# EAGLE design mcore-h616-breakout-RevA1 (EAGLE 9.6.2)

## Sheet 1 of 3
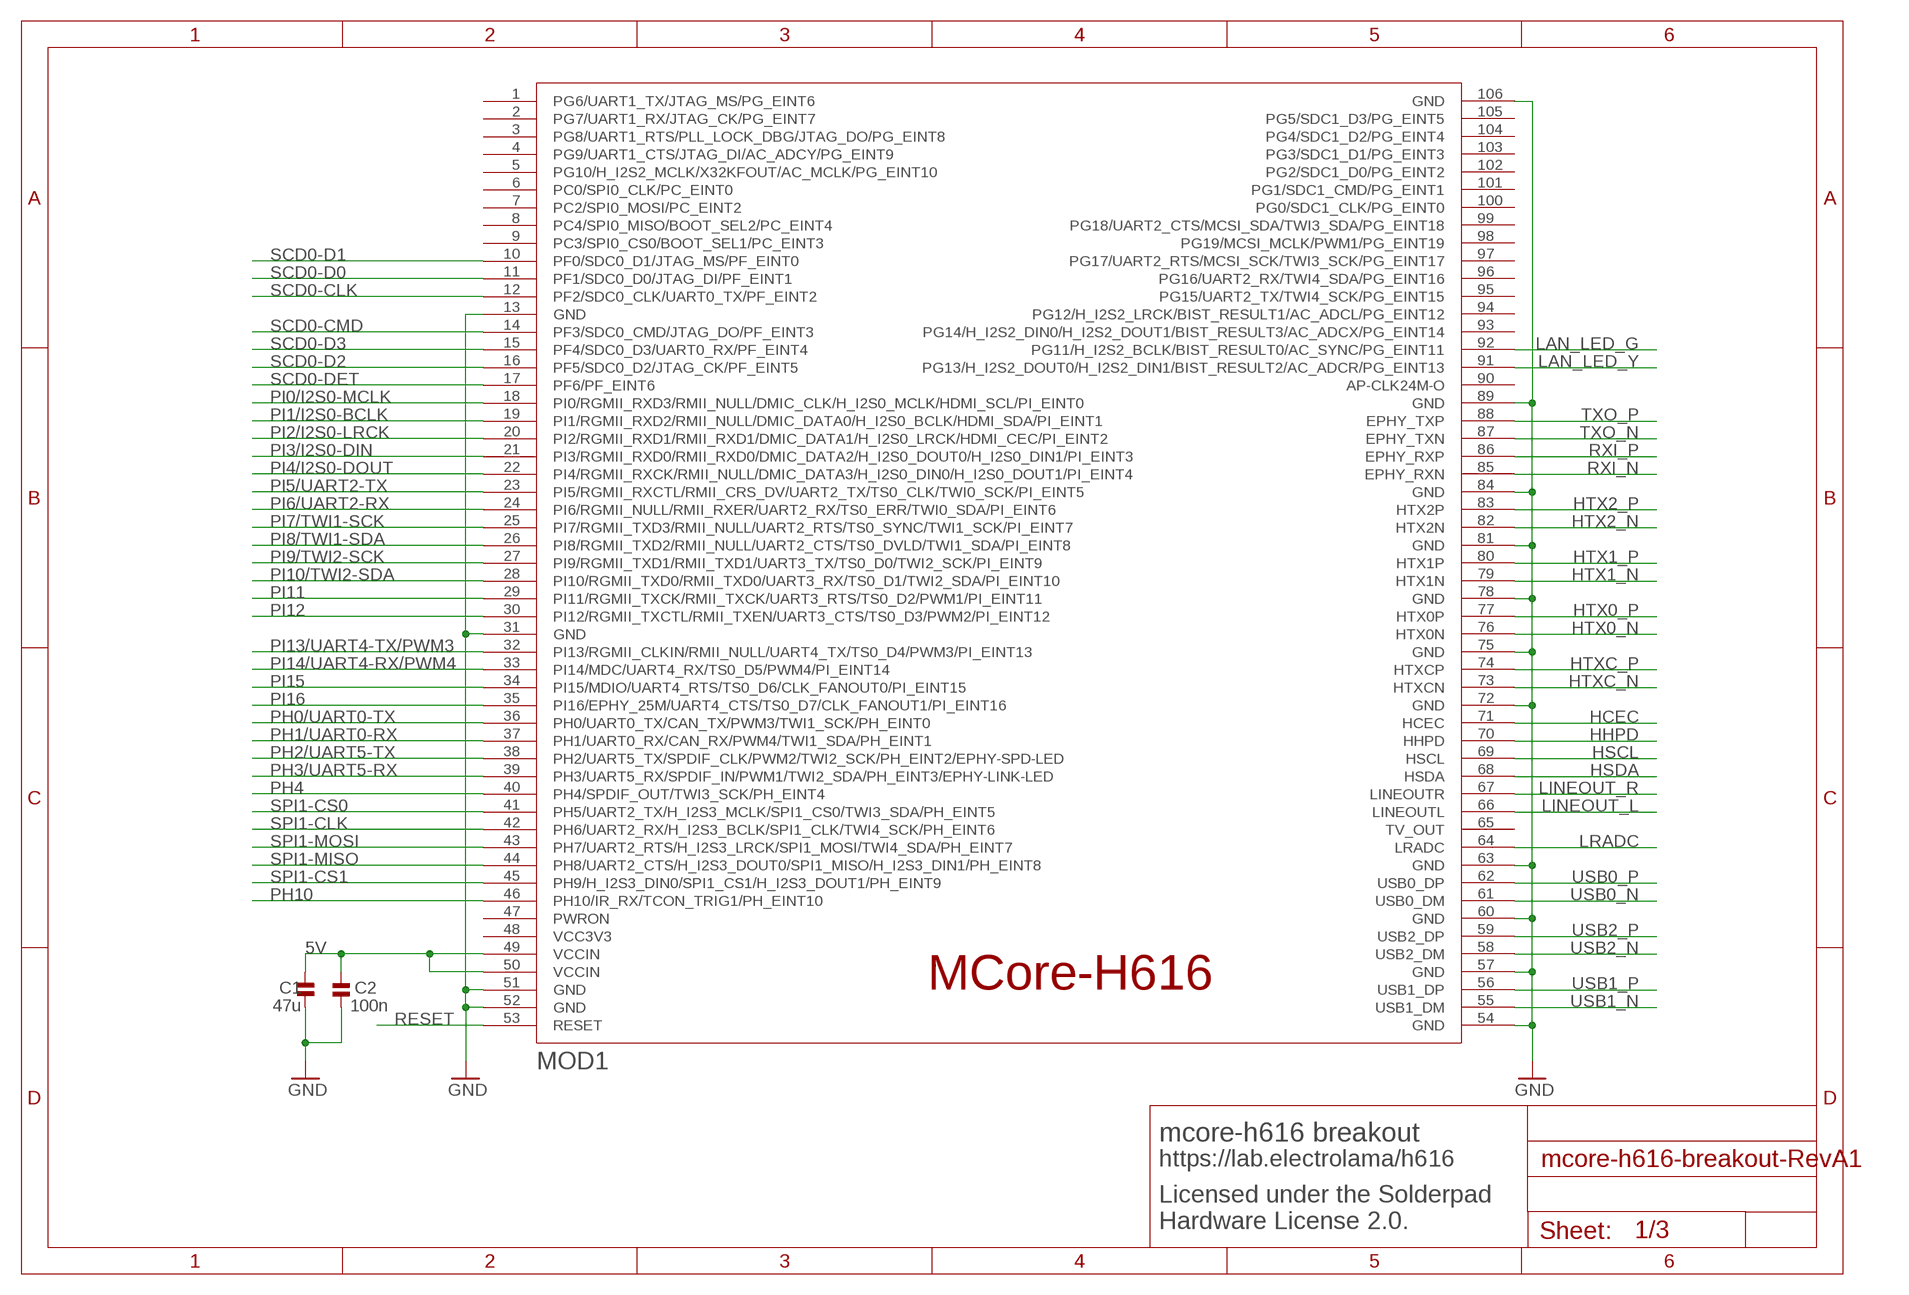
[diagram p0: schematic, sheet 1]

### Parts
C1  47u  CAP-1206  [_PKG_C_1206]
C2  100n  CAP-0402  [_PKG_C_0402]
MOD1  WIDORA_MCORE-H616_V1  [MCORE-H616_V1]

### Nets
5V: C1.2 C2.2 MOD1.49(VCCIN) MOD1.50(VCCIN) ; also sheet 2,3
GND: C1.1 C2.1 MOD1.13(GND) MOD1.31(GND) MOD1.51(GND) MOD1.52(GND) MOD1.54(GND) MOD1.57(GND) MOD1.60(GND) MOD1.63(GND) MOD1.72(GND) MOD1.75(GND) MOD1.78(GND) MOD1.81(GND) MOD1.84(GND) MOD1.89(GND) MOD1.106(GND) ; also sheet 2,3
HCEC: MOD1.71(HCEC) ; also sheet 3
HHPD: MOD1.70(HHPD) ; also sheet 3
HSCL: MOD1.69(HSCL) ; also sheet 3
HSDA: MOD1.68(HSDA) ; also sheet 3
HTX0_N: MOD1.76(HTX0N) ; also sheet 3
HTX0_P: MOD1.77(HTX0P) ; also sheet 3
HTX1_N: MOD1.79(HTX1N) ; also sheet 3
HTX1_P: MOD1.80(HTX1P) ; also sheet 3
HTX2_N: MOD1.82(HTX2N) ; also sheet 3
HTX2_P: MOD1.83(HTX2P) ; also sheet 3
HTXC_N: MOD1.73(HTXCN) ; also sheet 3
HTXC_P: MOD1.74(HTXCP) ; also sheet 3
LAN_LED_G: MOD1.92(PG11/H_I2S2_BCLK/BIST_RESULT0/AC_SYNC/PG_EINT11) ; also sheet 3
LAN_LED_Y: MOD1.91(PG13/H_I2S2_DOUT0/H_I2S2_DIN1/BIST_RESULT2/AC_ADCR/PG_EINT13) ; also sheet 3
LINEOUT_L: MOD1.66(LINEOUTL) ; also sheet 2
LINEOUT_R: MOD1.67(LINEOUTR) ; also sheet 2
LRADC: MOD1.64(LRADC) ; also sheet 2
PH0/UART0-TX: MOD1.36(PH0/UART0_TX/CAN_TX/PWM3/TWI1_SCK/PH_EINT0) ; also sheet 2,3
PH1/UART0-RX: MOD1.37(PH1/UART0_RX/CAN_RX/PWM4/TWI1_SDA/PH_EINT1) ; also sheet 2,3
PH2/UART5-TX: MOD1.38(PH2/UART5_TX/SPDIF_CLK/PWM2/TWI2_SCK/PH_EINT2/EPHY-SPD-LED) ; also sheet 3
PH3/UART5-RX: MOD1.39(PH3/UART5_RX/SPDIF_IN/PWM1/TWI2_SDA/PH_EINT3/EPHY-LINK-LED) ; also sheet 3
PH4: MOD1.40(PH4/SPDIF_OUT/TWI3_SCK/PH_EINT4) ; also sheet 3
PH10: MOD1.46(PH10/IR_RX/TCON_TRIG1/PH_EINT10) ; also sheet 3
PI0/I2S0-MCLK: MOD1.18(PI0/RGMII_RXD3/RMII_NULL/DMIC_CLK/H_I2S0_MCLK/HDMI_SCL/PI_EINT0) ; also sheet 3
PI1/I2S0-BCLK: MOD1.19(PI1/RGMII_RXD2/RMII_NULL/DMIC_DATA0/H_I2S0_BCLK/HDMI_SDA/PI_EINT1) ; also sheet 3
PI2/I2S0-LRCK: MOD1.20(PI2/RGMII_RXD1/RMII_RXD1/DMIC_DATA1/H_I2S0_LRCK/HDMI_CEC/PI_EINT2) ; also sheet 3
PI3/I2S0-DIN: MOD1.21(PI3/RGMII_RXD0/RMII_RXD0/DMIC_DATA2/H_I2S0_DOUT0/H_I2S0_DIN1/PI_EINT3) ; also sheet 3
PI4/I2S0-DOUT: MOD1.22(PI4/RGMII_RXCK/RMII_NULL/DMIC_DATA3/H_I2S0_DIN0/H_I2S0_DOUT1/PI_EINT4) ; also sheet 3
PI5/UART2-TX: MOD1.23(PI5/RGMII_RXCTL/RMII_CRS_DV/UART2_TX/TS0_CLK/TWI0_SCK/PI_EINT5) ; also sheet 3
PI6/UART2-RX: MOD1.24(PI6/RGMII_NULL/RMII_RXER/UART2_RX/TS0_ERR/TWI0_SDA/PI_EINT6) ; also sheet 3
PI7/TWI1-SCK: MOD1.25(PI7/RGMII_TXD3/RMII_NULL/UART2_RTS/TS0_SYNC/TWI1_SCK/PI_EINT7) ; also sheet 3
PI8/TWI1-SDA: MOD1.26(PI8/RGMII_TXD2/RMII_NULL/UART2_CTS/TS0_DVLD/TWI1_SDA/PI_EINT8) ; also sheet 3
PI9/TWI2-SCK: MOD1.27(PI9/RGMII_TXD1/RMII_TXD1/UART3_TX/TS0_D0/TWI2_SCK/PI_EINT9) ; also sheet 3
PI10/TWI2-SDA: MOD1.28(PI10/RGMII_TXD0/RMII_TXD0/UART3_RX/TS0_D1/TWI2_SDA/PI_EINT10) ; also sheet 3
PI11: MOD1.29(PI11/RGMII_TXCK/RMII_TXCK/UART3_RTS/TS0_D2/PWM1/PI_EINT11) ; also sheet 3
PI12: MOD1.30(PI12/RGMII_TXCTL/RMII_TXEN/UART3_CTS/TS0_D3/PWM2/PI_EINT12) ; also sheet 3
PI13/UART4-TX/PWM3: MOD1.32(PI13/RGMII_CLKIN/RMII_NULL/UART4_TX/TS0_D4/PWM3/PI_EINT13) ; also sheet 3
PI14/UART4-RX/PWM4: MOD1.33(PI14/MDC/UART4_RX/TS0_D5/PWM4/PI_EINT14) ; also sheet 3
PI15: MOD1.34(PI15/MDIO/UART4_RTS/TS0_D6/CLK_FANOUT0/PI_EINT15) ; also sheet 3
PI16: MOD1.35(PI16/EPHY_25M/UART4_CTS/TS0_D7/CLK_FANOUT1/PI_EINT16) ; also sheet 3
RESET: MOD1.53(RESET) ; also sheet 2
RXI_N: MOD1.85(EPHY_RXN) ; also sheet 3
RXI_P: MOD1.86(EPHY_RXP) ; also sheet 3
SCD0-CLK: MOD1.12(PF2/SDC0_CLK/UART0_TX/PF_EINT2) ; also sheet 3
SCD0-CMD: MOD1.14(PF3/SDC0_CMD/JTAG_DO/PF_EINT3) ; also sheet 3
SCD0-D0: MOD1.11(PF1/SDC0_D0/JTAG_DI/PF_EINT1) ; also sheet 3
SCD0-D1: MOD1.10(PF0/SDC0_D1/JTAG_MS/PF_EINT0) ; also sheet 3
SCD0-D2: MOD1.16(PF5/SDC0_D2/JTAG_CK/PF_EINT5) ; also sheet 3
SCD0-D3: MOD1.15(PF4/SDC0_D3/UART0_RX/PF_EINT4) ; also sheet 3
SCD0-DET: MOD1.17(PF6/PF_EINT6) ; also sheet 3
SPI1-CLK: MOD1.42(PH6/UART2_RX/H_I2S3_BCLK/SPI1_CLK/TWI4_SCK/PH_EINT6) ; also sheet 3
SPI1-CS0: MOD1.41(PH5/UART2_TX/H_I2S3_MCLK/SPI1_CS0/TWI3_SDA/PH_EINT5) ; also sheet 3
SPI1-CS1: MOD1.45(PH9/H_I2S3_DIN0/SPI1_CS1/H_I2S3_DOUT1/PH_EINT9) ; also sheet 3
SPI1-MISO: MOD1.44(PH8/UART2_CTS/H_I2S3_DOUT0/SPI1_MISO/H_I2S3_DIN1/PH_EINT8) ; also sheet 3
SPI1-MOSI: MOD1.43(PH7/UART2_RTS/H_I2S3_LRCK/SPI1_MOSI/TWI4_SDA/PH_EINT7) ; also sheet 3
TXO_N: MOD1.87(EPHY_TXN) ; also sheet 3
TXO_P: MOD1.88(EPHY_TXP) ; also sheet 3
USB0_N: MOD1.61(USB0_DM) ; also sheet 2
USB0_P: MOD1.62(USB0_DP) ; also sheet 2
USB1_N: MOD1.55(USB1_DM) ; also sheet 2
USB1_P: MOD1.56(USB1_DP) ; also sheet 2
USB2_N: MOD1.58(USB2_DM) ; also sheet 2
USB2_P: MOD1.59(USB2_DP) ; also sheet 2
Unconnected: MOD1.1(PG6/UART1_TX/JTAG_MS/PG_EINT6) MOD1.2(PG7/UART1_RX/JTAG_CK/PG_EINT7) MOD1.3(PG8/UART1_RTS/PLL_LOCK_DBG/JTAG_DO/PG_EINT8) MOD1.4(PG9/UART1_CTS/JTAG_DI/AC_ADCY/PG_EINT9) MOD1.5(PG10/H_I2S2_MCLK/X32KFOUT/AC_MCLK/PG_EINT10) MOD1.6(PC0/SPI0_CLK/PC_EINT0) MOD1.7(PC2/SPI0_MOSI/PC_EINT2) MOD1.8(PC4/SPI0_MISO/BOOT_SEL2/PC_EINT4) MOD1.9(PC3/SPI0_CS0/BOOT_SEL1/PC_EINT3) MOD1.47(PWRON) MOD1.48(VCC3V3) MOD1.65(TV_OUT) MOD1.90(AP-CLK24M-O) MOD1.93(PG14/H_I2S2_DIN0/H_I2S2_DOUT1/BIST_RESULT3/AC_ADCX/PG_EINT14) MOD1.94(PG12/H_I2S2_LRCK/BIST_RESULT1/AC_ADCL/PG_EINT12) MOD1.95(PG15/UART2_TX/TWI4_SCK/PG_EINT15) MOD1.96(PG16/UART2_RX/TWI4_SDA/PG_EINT16) MOD1.97(PG17/UART2_RTS/MCSI_SCK/TWI3_SCK/PG_EINT17) MOD1.98(PG19/MCSI_MCLK/PWM1/PG_EINT19) MOD1.99(PG18/UART2_CTS/MCSI_SDA/TWI3_SDA/PG_EINT18) MOD1.100(PG0/SDC1_CLK/PG_EINT0) MOD1.101(PG1/SDC1_CMD/PG_EINT1) MOD1.102(PG2/SDC1_D0/PG_EINT2) MOD1.103(PG3/SDC1_D1/PG_EINT3) MOD1.104(PG4/SDC1_D2/PG_EINT4) MOD1.105(PG5/SDC1_D3/PG_EINT5)

### Notes on the sheet
- mcore-h616 breakout
- https://lab.electrolama/h616
- Licensed under the Solderpad
  Hardware License 2.0.

## Sheet 2 of 3
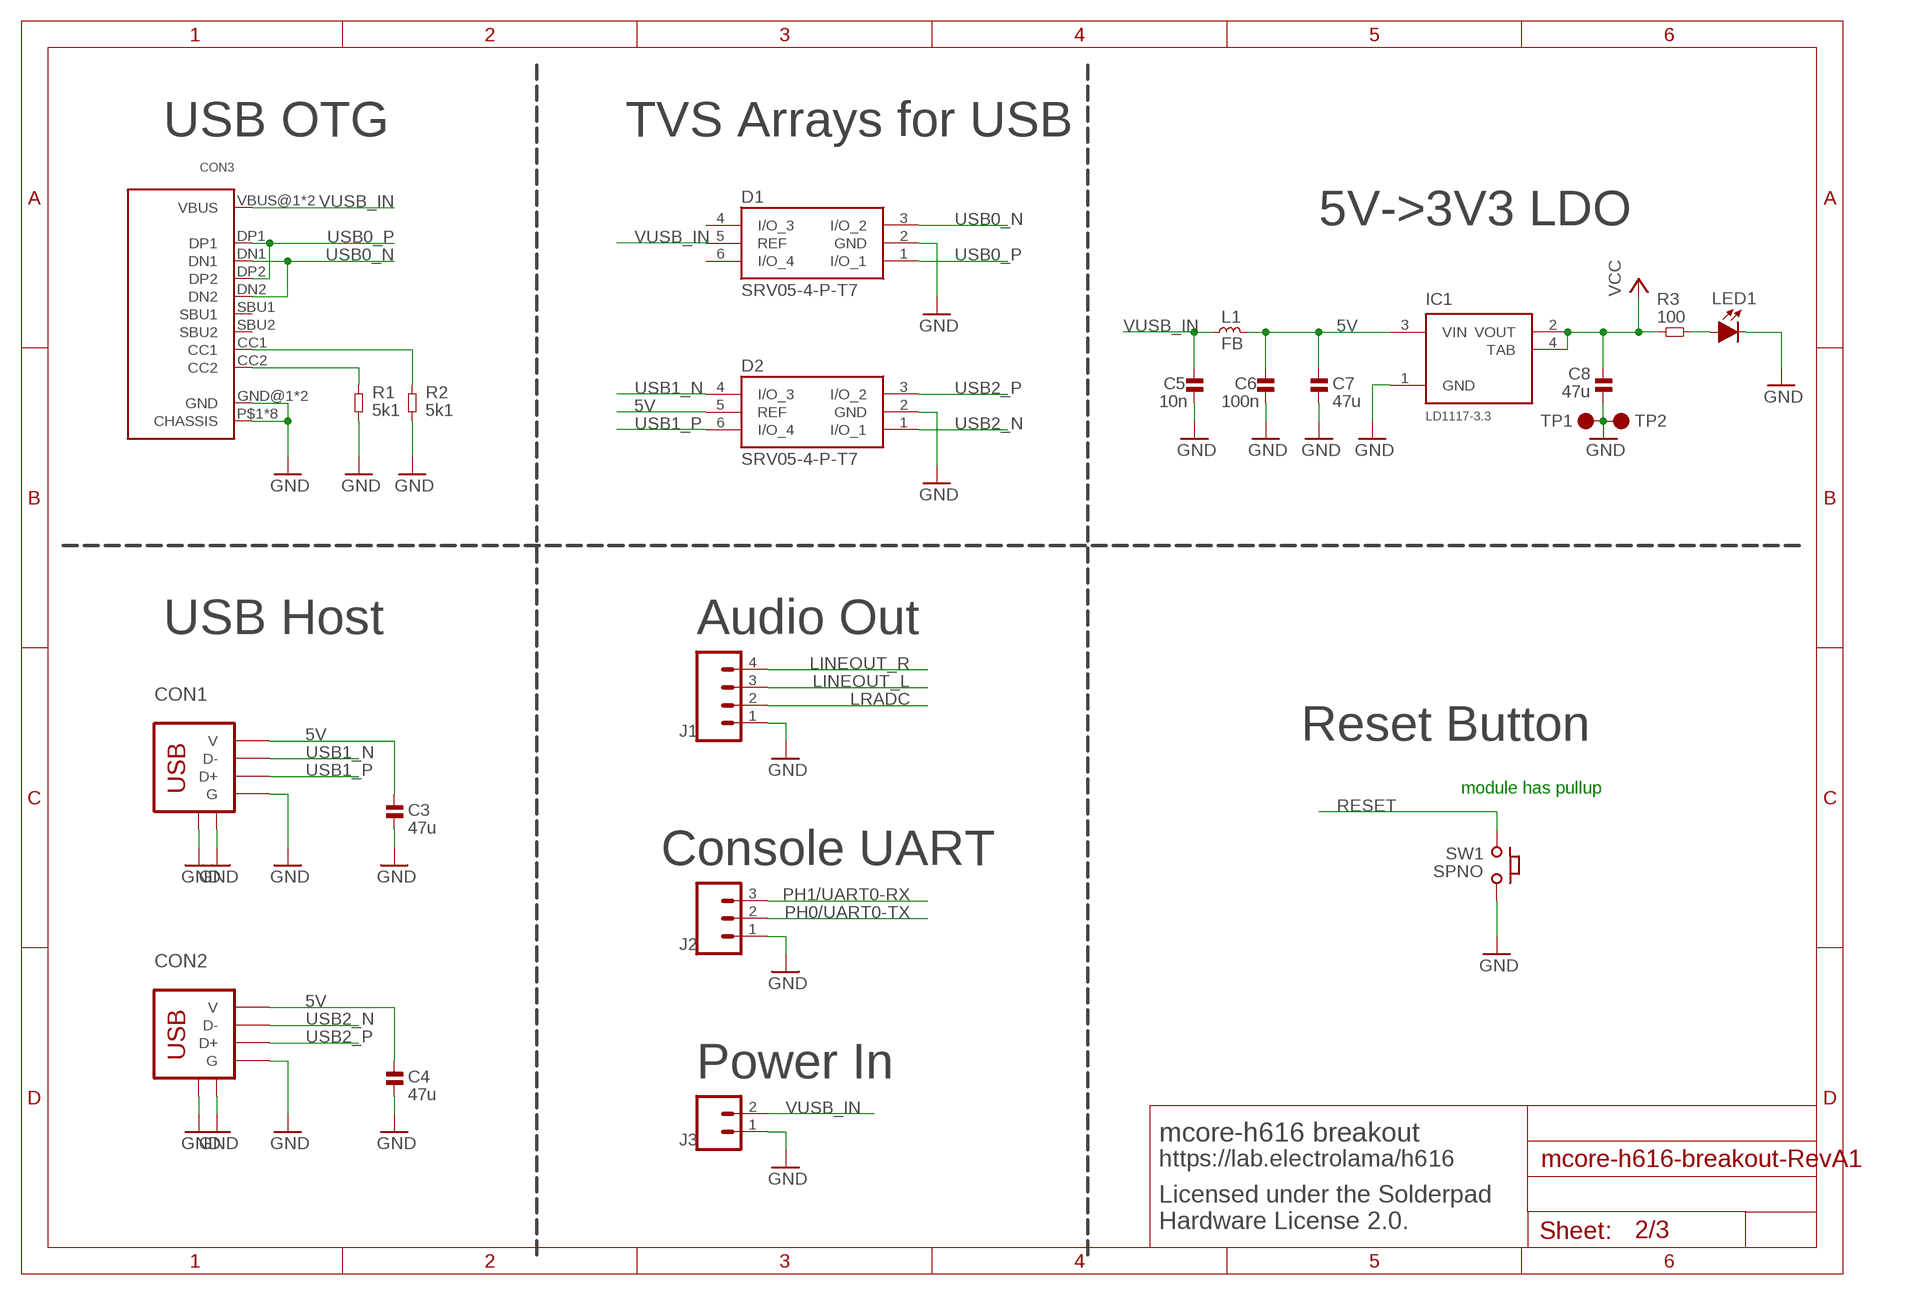
[diagram p1: schematic, sheet 2]

### Parts
C3  47u  CAP-1206  [_PKG_C_1206]
C4  47u  CAP-1206  [_PKG_C_1206]
C5  10n  CAP-0402  [_PKG_C_0402]
C6  100n  CAP-0402  [_PKG_C_0402]
C7  47u  CAP-1206  [_PKG_C_1206]
C8  47u  CAP-1206  [_PKG_C_1206]
CON1  USB-A-FEMALE-JING-912-121A2023S10100  [JING_912-121A2023S10100]
CON2  USB-A-FEMALE-JING-912-121A2023S10100  [JING_912-121A2023S10100]
CON3  USBC_USB-C-12  [USBC_C-31-M-12]
D1  SRV05-4-P-T7  DIODE-TVS-SRV05-4  [SOT95P280X145-6N]
D2  SRV05-4-P-T7  DIODE-TVS-SRV05-4  [SOT95P280X145-6N]
IC1  LD1117-3.3  POWER-LDO-LD1117-SOT223-4  [_PKG_SOT223-4_TI-DCY4]
J1  CONN_04LOCK  [1X04_LOCK]
J2  CONN_03LOCK  [1X03_LOCK]
J3  CONN_02LOCK  [1X02_LOCK]
L1  FB  INDUCTOR-0805  [_PKG_C_0805]
LED1  LED-0805  [_PKG_LED_0805]
R1  5k1  RES-0402  [_PKG_R_0402]
R2  5k1  RES-0402  [_PKG_R_0402]
R3  100  RES-0402  [_PKG_R_0402]
SW1  SPNO  PUSHBUTTON-6X6MM  [GENERIC_SPNO_4P_6X6MM]
TP1  TP  [TP_DOT_1.5X1.5MM]
TP2  TP  [TP_DOT_1.5X1.5MM]

### Nets
5V: C3.2 C4.2 C6.2 C7.2 CON1.VBUS(V) CON2.VBUS(V) D2.5(REF) IC1.3(VIN) L1.2 ; also sheet 1,3
GND: C3.1 C4.1 C5.1 C6.1 C7.1 C8.1 CON1.GND(G) CON1.P$5(SHIELD1) CON1.P$6(SHIELD2) CON2.GND(G) CON2.P$5(SHIELD1) CON2.P$6(SHIELD2) CON3.GND@1(GND) CON3.GND@2(GND) CON3.P$1(CHASSIS) CON3.P$2(CHASSIS) CON3.P$3(CHASSIS) CON3.P$4(CHASSIS) CON3.P$5(CHASSIS) CON3.P$6(CHASSIS) CON3.P$7(CHASSIS) CON3.P$8(CHASSIS) D1.2(GND) D2.2(GND) IC1.1(GND) J1.1 J2.1 J3.1 LED1.C R1.1 R2.1 SW1.P$3 SW1.P$4 TP1.TP TP2.TP ; also sheet 1,3
LINEOUT_L: J1.3 ; also sheet 1
LINEOUT_R: J1.4 ; also sheet 1
LRADC: J1.2 ; also sheet 1
N$1: LED1.A R3.1
N$9: CON3.CC1 R2.2
N$10: CON3.CC2 R1.2
PH0/UART0-TX: J2.2 ; also sheet 1,3
PH1/UART0-RX: J2.3 ; also sheet 1,3
RESET: SW1.P$1 SW1.P$2 ; also sheet 1
USB0_N: CON3.DN1 CON3.DN2 D1.3(I/O_2) ; also sheet 1
USB0_P: CON3.DP1 CON3.DP2 D1.1(I/O_1) ; also sheet 1
USB1_N: CON1.DM(D-) D2.4(I/O_3) ; also sheet 1
USB1_P: CON1.DP(D+) D2.6(I/O_4) ; also sheet 1
USB2_N: CON2.DM(D-) D2.1(I/O_1) ; also sheet 1
USB2_P: CON2.DP(D+) D2.3(I/O_2) ; also sheet 1
VCC: C8.2 IC1.2(VOUT) IC1.4(TAB) R3.2 ; also sheet 3
VUSB_IN: C5.2 CON3.VBUS@1(VBUS) CON3.VBUS@2(VBUS) D1.5(REF) J3.2 L1.1
Unconnected: CON3.SBU1 CON3.SBU2 D1.4(I/O_3) D1.6(I/O_4)

### Notes on the sheet
- USB OTG | TVS Arrays for USB
- 5V->3V3 LDO
- USB Host | Audio Out
- Reset Button
- module has pullup
- Console UART
- Power In
- mcore-h616 breakout
- https://lab.electrolama/h616
- Licensed under the Solderpad
  Hardware License 2.0.

## Sheet 3 of 3
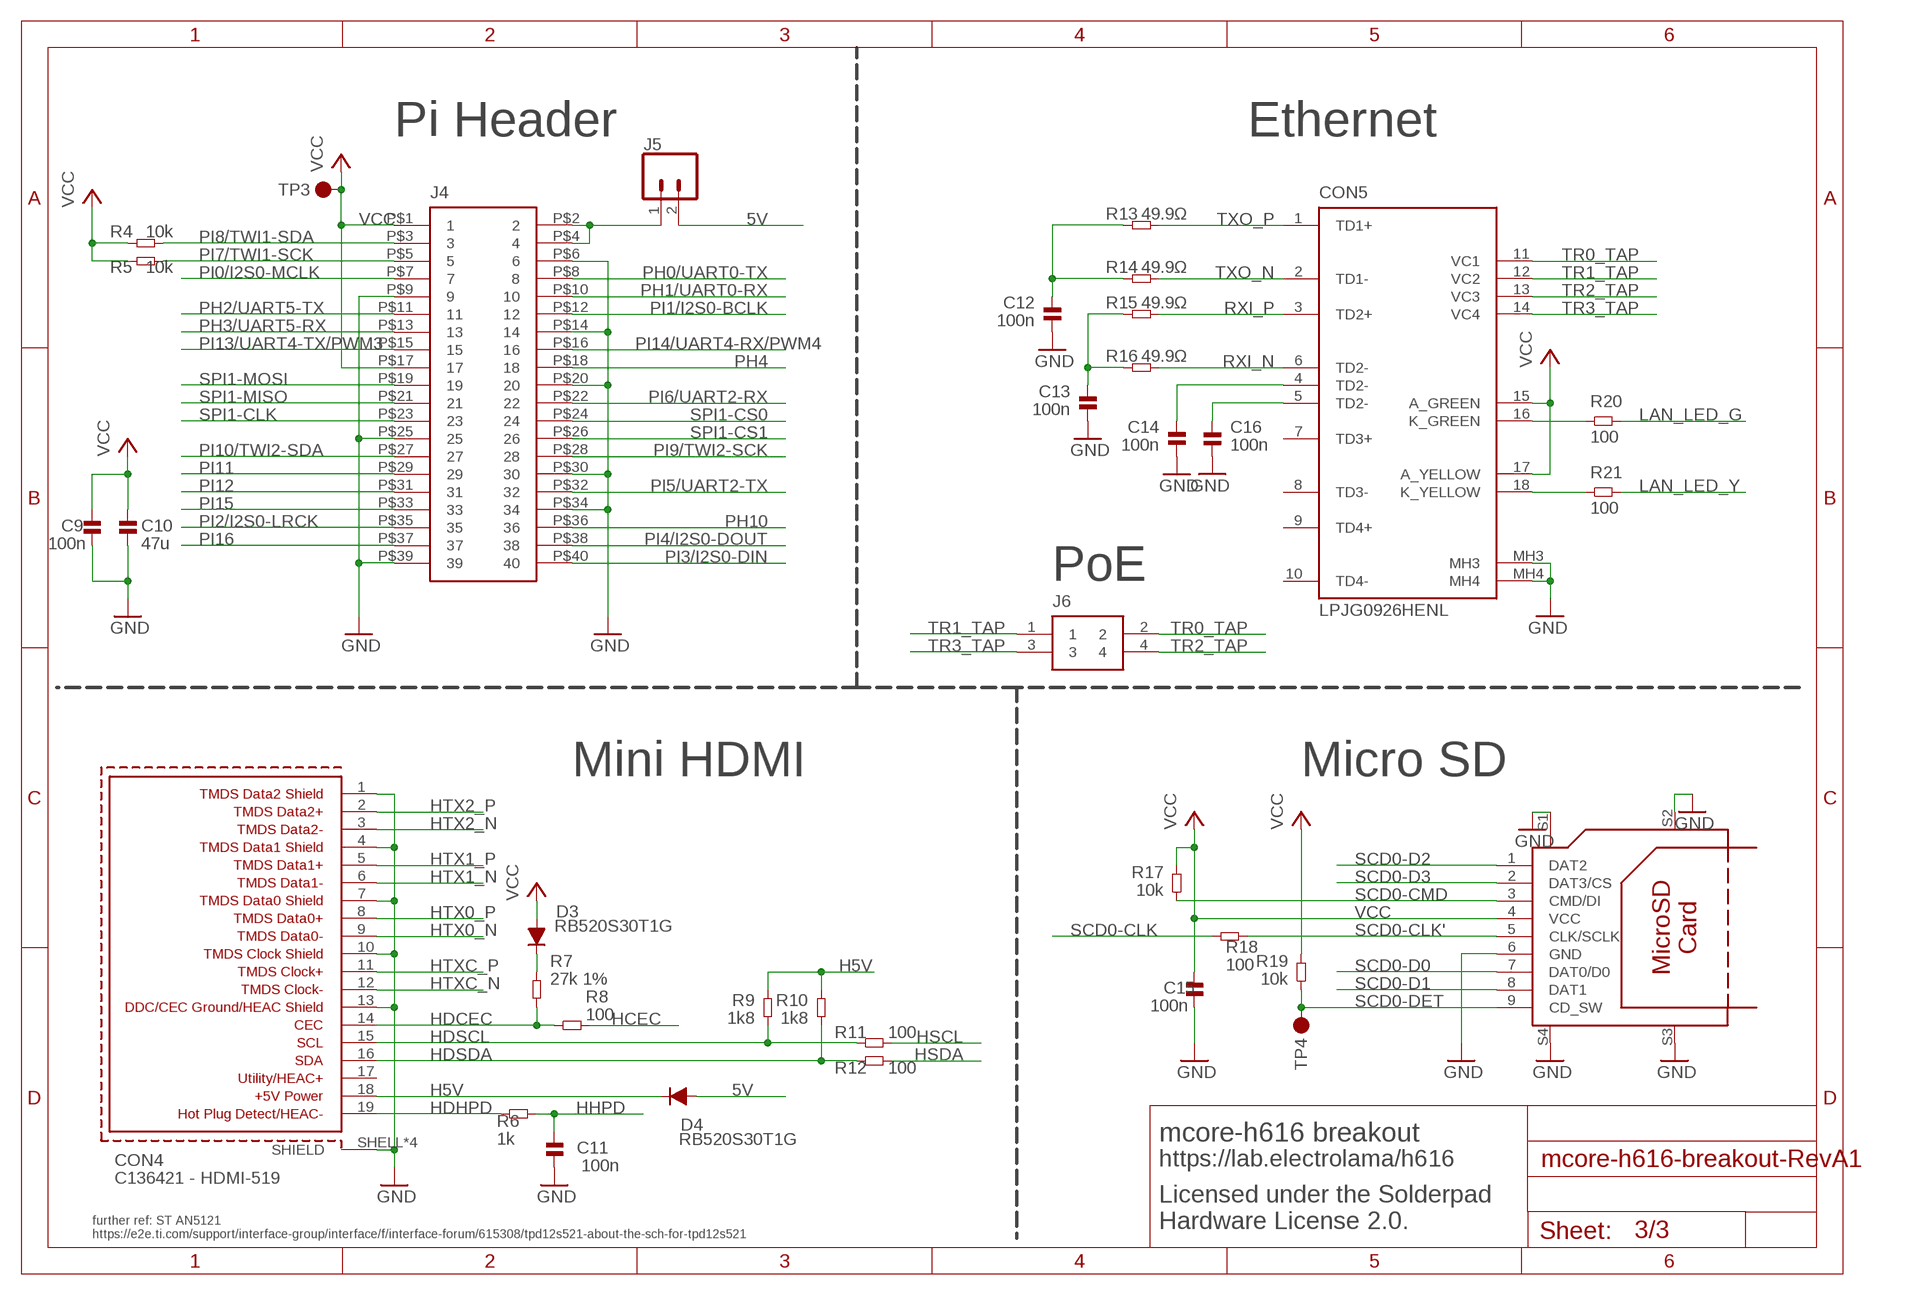
[diagram p2: schematic, sheet 3]

### Parts
C9  100n  CAP-0402  [_PKG_C_0402]
C10  47u  CAP-1206  [_PKG_C_1206]
C11  100n  CAP-0402  [_PKG_C_0402]
C12  100n  CAP-0402  [_PKG_C_0402]
C13  100n  CAP-0402  [_PKG_C_0402]
C14  100n  CAP-0402  [_PKG_C_0402]
C15  100n  CAP-0402  [_PKG_C_0402]
C16  100n  CAP-0402  [_PKG_C_0402]
CON4  C136421 - HDMI-519  685119136923  [685119136923]
CON5  LPJG0926HENL  RJ45_POE_LPJG0926HENL  [LPJG0926HENL]
CON6  C111196 - TF-15x15  TF/SHENZHEN-SPECIAL  [TF/SHENZHEN-SPECIAL]
D3  RB520S30T1G  DIODE-SCHOTTKY-RB520S30  [_PKG_SOD523]
D4  RB520S30T1G  DIODE-SCHOTTKY-RB520S30  [_PKG_SOD523]
J4  CON_2.54MM_TH_2X20  [CON_2.54MM_TH_2X20]
J5  CONN_02LOCK  [1X02_LOCK]
J6  CON_2.54MM_TH_2X2  [CON_2.54MM_TH_2X2]
R4  10k  RES-0402  [_PKG_R_0402]
R5  10k  RES-0402  [_PKG_R_0402]
R6  1k  RES-0402  [_PKG_R_0402]
R7  27k 1%  RES-0402  [_PKG_R_0402]
R8  100  RES-0402  [_PKG_R_0402]
R9  1k8  RES-0402  [_PKG_R_0402]
R10  1k8  RES-0402  [_PKG_R_0402]
R11  100  RES-0402  [_PKG_R_0402]
R12  100  RES-0402  [_PKG_R_0402]
R13  49.9Ω  RES-0402  [_PKG_R_0402]
R14  49.9Ω  RES-0402  [_PKG_R_0402]
R15  49.9Ω  RES-0402  [_PKG_R_0402]
R16  49.9Ω  RES-0402  [_PKG_R_0402]
R17  10k  RES-0402  [_PKG_R_0402]
R18  100  RES-0402  [_PKG_R_0402]
R19  10k  RES-0402  [_PKG_R_0402]
R20  100  RES-0402  [_PKG_R_0402]
R21  100  RES-0402  [_PKG_R_0402]
TP3  TP  [TP_DOT_1.5X1.5MM]
TP4  TP  [TP_DOT_1.5X1.5MM]

### Nets
5V: D4.2(A) J5.2 ; also sheet 1,2
GND: C9.1 C10.1 C11.1 C12.1 C13.1 C14.1 C15.1 C16.1 CON4.1(TMDSDATA2SHIELD) CON4.4(TMDSDATA1SHIELD) CON4.7(TMDSDATA0SHIELD) CON4.10(TMDSCLOCKSHIELD) CON4.13(DDC/CECGROUND/HEACSHIELD) CON4.SHELL1(SHIELD) CON4.SHELL2(SHIELD) CON4.SHELL3(SHIELD) CON4.SHELL(SHIELD) CON5.MH3 CON5.MH4 CON6.6(GND) CON6.S1 CON6.S2 CON6.S3 CON6.S4 J4.P$6 J4.P$9 J4.P$14 J4.P$20 J4.P$25 J4.P$30 J4.P$34 J4.P$39 ; also sheet 1,2
H5V: CON4.18(+5VPOWER) D4.1(C) R9.1 R10.1
HCEC: R8.2 ; also sheet 1
HDCEC: CON4.14(CEC) R7.1 R8.1
HDHPD: CON4.19(HOTPLUGDETECT/HEAC-) R6.1
HDSCL: CON4.15(SCL) R9.2 R11.1
HDSDA: CON4.16(SDA) R10.2 R12.1
HHPD: C11.2 R6.2 ; also sheet 1
HSCL: R11.2 ; also sheet 1
HSDA: R12.2 ; also sheet 1
HTX0_N: CON4.9(TMDSDATA0-) ; also sheet 1
HTX0_P: CON4.8(TMDSDATA0+) ; also sheet 1
HTX1_N: CON4.6(TMDSDATA1-) ; also sheet 1
HTX1_P: CON4.5(TMDSDATA1+) ; also sheet 1
HTX2_N: CON4.3(TMDSDATA2-) ; also sheet 1
HTX2_P: CON4.2(TMDSDATA2+) ; also sheet 1
HTXC_N: CON4.12(TMDSCLOCK-) ; also sheet 1
HTXC_P: CON4.11(TMDSCLOCK+) ; also sheet 1
LAN_LED_G: R20.2 ; also sheet 1
LAN_LED_Y: R21.2 ; also sheet 1
N$2: CON5.16(K_GREEN) R20.1
N$3: C14.2 CON5.4(TD2-)
N$4: C16.2 CON5.5(TD2-)
N$5: J4.P$2 J4.P$4 J5.1
N$6: CON5.18(K_YELLOW) R21.1
N$7: D3.1(C) R7.2
N$30: C12.2 R13.1 R14.1
N$31: C13.2 R15.1 R16.1
PH0/UART0-TX: J4.P$8 ; also sheet 1,2
PH1/UART0-RX: J4.P$10 ; also sheet 1,2
PH2/UART5-TX: J4.P$11 ; also sheet 1
PH3/UART5-RX: J4.P$13 ; also sheet 1
PH4: J4.P$18 ; also sheet 1
PH10: J4.P$36 ; also sheet 1
PI0/I2S0-MCLK: J4.P$7 ; also sheet 1
PI1/I2S0-BCLK: J4.P$12 ; also sheet 1
PI2/I2S0-LRCK: J4.P$35 ; also sheet 1
PI3/I2S0-DIN: J4.P$40 ; also sheet 1
PI4/I2S0-DOUT: J4.P$38 ; also sheet 1
PI5/UART2-TX: J4.P$32 ; also sheet 1
PI6/UART2-RX: J4.P$22 ; also sheet 1
PI7/TWI1-SCK: J4.P$5 R5.2 ; also sheet 1
PI8/TWI1-SDA: J4.P$3 R4.2 ; also sheet 1
PI9/TWI2-SCK: J4.P$28 ; also sheet 1
PI10/TWI2-SDA: J4.P$27 ; also sheet 1
PI11: J4.P$29 ; also sheet 1
PI12: J4.P$31 ; also sheet 1
PI13/UART4-TX/PWM3: J4.P$15 ; also sheet 1
PI14/UART4-RX/PWM4: J4.P$16 ; also sheet 1
PI15: J4.P$33 ; also sheet 1
PI16: J4.P$37 ; also sheet 1
RXI_N: CON5.6(TD2-) R16.2 ; also sheet 1
RXI_P: CON5.3(TD2+) R15.2 ; also sheet 1
SCD0-CLK: R18.2 ; also sheet 1
SCD0-CLK': CON6.5(CLK/SCLK) R18.1
SCD0-CMD: CON6.3(CMD/DI) R17.1 ; also sheet 1
SCD0-D0: CON6.7(DAT0/D0) ; also sheet 1
SCD0-D1: CON6.8(DAT1) ; also sheet 1
SCD0-D2: CON6.1(DAT2) ; also sheet 1
SCD0-D3: CON6.2(DAT3/CS) ; also sheet 1
SCD0-DET: CON6.9(CD_SW) R19.1 TP4.TP ; also sheet 1
SPI1-CLK: J4.P$23 ; also sheet 1
SPI1-CS0: J4.P$24 ; also sheet 1
SPI1-CS1: J4.P$26 ; also sheet 1
SPI1-MISO: J4.P$21 ; also sheet 1
SPI1-MOSI: J4.P$19 ; also sheet 1
TR0_TAP: CON5.11(VC1) J6.2
TR1_TAP: CON5.12(VC2) J6.1
TR2_TAP: CON5.13(VC3) J6.4
TR3_TAP: CON5.14(VC4) J6.3
TXO_N: CON5.2(TD1-) R14.2 ; also sheet 1
TXO_P: CON5.1(TD1+) R13.2 ; also sheet 1
VCC: C9.2 C10.2 C15.2 CON5.15(A_GREEN) CON5.17(A_YELLOW) CON6.4(VCC) D3.2(A) J4.P$1 J4.P$17 R4.1 R5.1 R17.2 R19.2 TP3.TP ; also sheet 2
Unconnected: CON4.17(UTILITY/HEAC+) CON5.7(TD3+) CON5.8(TD3-) CON5.9(TD4+) CON5.10(TD4-)

### Notes on the sheet
- Pi Header | Ethernet
- PoE
- Mini HDMI | Micro SD
- mcore-h616 breakout
- https://lab.electrolama/h616
- Licensed under the Solderpad
  Hardware License 2.0.
- further ref: ST AN5121
  https://e2e.ti.com/support/interface-group/interface/f/interface-forum/615308/tpd12s521-about-the-sch-for-tpd12s521

## Library data of the parts
C1 C3 C4 C7 C8 C10 = ok-discretes-dev:CAP; JLCASSY: C96123
C2 C6 C9 C11-C16 = ok-discretes-dev:CAP; JLCASSY: C307331
C5 = ok-discretes-dev:CAP; JLCASSY: C15195
CON1 CON2 = ok-connectors-dev:USB-A-FEMALE-JING-912-121A2023S10100; JLCASSY: C42428
CON3 = ok-connectors-dev:USBC_USB-C-12; JLCASSY: C165948
CON4 = Wurth_Connectors_WR-HDMI:685119136923: WR-COM Mini HDMI SMT Horizontal <https://www.we-online.com/catalog/media/o33017v209%20Family_WR-COM_685119136923.jpg> Details see: https://www.we-online.com/catalog/en/COM_MINI_SMT_HORIZONTAL/ Updated by Ella Wu 2020-01-16 2020(C) Würth Elektronik; DATASHEET-URL: https://www.we-online.com/catalog/datasheet/685119136923.pdf; GERDER: Receptacle; JLCASSY: C136421; MOUNT: SMT; PART-NUMBER: 685119136923; PINS: 19; RATED-CURRENT: 0.5A; TYPE: Horizontal; WORKING-VOLTAGE: 40VAC
CON5 = ok-connectors-dev:RJ45_POE_LPJG0926HENL: LPJG0926HENL Source: Datasheet <https://www.l-p.com/file/datasheet/lpjg0926henl.pdf>; DESCRIPTION: LPJG0926HENL; HEIGHT: 13.5mm; MANUFACTURER_NAME: LINK-PP; MANUFACTURER_PART_NUMBER: LPJG0926HENL
CON6 = ok-connectors-dev:TF/SHENZHEN-SPECIAL; JLCASSY: C111196
D1 D2 = ok-discretes-dev:DIODE-TVS-SRV05-4: SRV05 Series 4 Ch 3.5 pF 15 Vclamp Steering Diode/TVS Array Combo - SOT-23-6 Source: Datasheet <https://datasheet.lcsc.com/szlcsc/1809192313_ProTek-Devices-SRV05-4-P-T7_C85364.pdf>; DESCRIPTION: SRV05 Series 4 Ch 3.5 pF 15 Vclamp Steering Diode/TVS Array Combo - SOT-23-6; HEIGHT: 1.45mm; JLCASSY: C85364; MANUFACTURER_NAME: ProTek Devices; MANUFACTURER_PART_NUMBER: SRV05-4-P-T7
D3 D4 = ok-discretes-dev:DIODE-SCHOTTKY: https://lcsc.com/product-detail/Schottky-Barrier-Diodes-SBD_ON-Semicon_RB520S30T1G_ON-Semicon-ON-RB520S30T1G_C154821.html; JLCASSY: C154821
IC1 = ok-chips-dev:POWER-LDO-LD1117; JLCASSY: C6186
J1 = SparkFun-Connectors:CONN_04: Multi connection point. Often used as Generic Header-pin footprint for 0.1 inch spaced/style header connections On any of the 0.1 inch spaced packages, you can populate with these: Break Away Headers - Straight <https://www.sparkfun.com/products/116> (PRT-00116) Break Away Male Headers - Right Angle <https://www.sparkfun.com/products/553> (PRT-00553) Female Headers <https://www.sparkfun.com/products/115> (PRT-00115) Break Away Headers - Machine Pin <https://www.sparkfun.com/products/117> (PRT-00117) Break Away Female Headers - Swiss Machine Pin <https://www.sparkfun.com/products/743> (PRT-00743) For SCREWTERMINALS and SPRING TERMINALS visit here: Screw Terimnals on SparkFun.com <https://www.sparkfun.com/search/results?term=Screw+Terminals> (5mm/3.5mm/2.54mm spacing) This device is also useful as a general connection point to wire up your design to another part of your project. Our various solder wires solder well into these plated through hole pads. Hook-Up Wire - Assortment (Stranded, 22 AWG) <https://www.sparkfun.com/products/11375> (PRT-11375) Hook-Up Wire - Assortment (Solid Core, 22 AWG) <https://www.sparkfun.com/products/11367> (PRT-11367) View the entire wire category on our website here <https://www.sparkfun.com/categories/141> Special notes: Molex polarized connector foot print use with SKU : PRT-08231 with associated crimp pins and housings. 1MM SMD Version SKU: PRT-10208; PROD_ID: CONN-09696
J2 = SparkFun-Connectors:CONN_03: Multi connection point. Often used as Generic Header-pin footprint for 0.1 inch spaced/style header connections On any of the 0.1 inch spaced packages, you can populate with these: Break Away Headers - Straight <https://www.sparkfun.com/products/116> (PRT-00116) Break Away Male Headers - Right Angle <https://www.sparkfun.com/products/553> (PRT-00553) Female Headers <https://www.sparkfun.com/products/115> (PRT-00115) Break Away Headers - Machine Pin <https://www.sparkfun.com/products/117> (PRT-00117) Break Away Female Headers - Swiss Machine Pin <https://www.sparkfun.com/products/743> (PRT-00743) Stackable Header - 3 Pin (Female, 0.1") <https://www.sparkfun.com/products/13875> (PRT-13875) For SCREWTERMINALS and SPRING TERMINALS visit here: Screw Terimnals on SparkFun.com <https://www.sparkfun.com/search/results?term=Screw+Terminals> (5mm/3.5mm/2.54mm spacing) This device is also useful as a general connection point to wire up your design to another part of your project. Our various solder wires solder well into these plated through hole pads. Hook-Up Wire - Assortment (Stranded, 22 AWG) <https://www.sparkfun.com/products/11375> (PRT-11375) Hook-Up Wire - Assortment (Solid Core, 22 AWG) <https://www.sparkfun.com/products/11367> (PRT-11367) View the entire wire category on our website here <https://www.sparkfun.com/categories/141> Special notes: Molex polarized connector foot print use with SKU : PRT-08232 with associated crimp pins and housings.
J3 J5 = SparkFun-Connectors:CONN_02: Multi connection point. Often used as Generic Header-pin footprint for 0.1 inch spaced/style header connections On any of the 0.1 inch spaced packages, you can populate with these: Break Away Headers - Straight <https://www.sparkfun.com/products/116> (PRT-00116) Break Away Male Headers - Right Angle <https://www.sparkfun.com/products/553> (PRT-00553) Female Headers <https://www.sparkfun.com/products/115> (PRT-00115) Break Away Headers - Machine Pin <https://www.sparkfun.com/products/117> (PRT-00117) Break Away Female Headers - Swiss Machine Pin <https://www.sparkfun.com/products/743> (PRT-00743) For SCREWTERMINALS and SPRING TERMINALS visit here: Screw Terimnals on SparkFun.com <https://www.sparkfun.com/search/results?term=Screw+Terminals> (5mm/3.5mm/2.54mm spacing) This device is also useful as a general connection point to wire up your design to another part of your project. Our various solder wires solder well into these plated through hole pads. Hook-Up Wire - Assortment (Stranded, 22 AWG) <https://www.sparkfun.com/products/11375> (PRT-11375) Hook-Up Wire - Assortment (Solid Core, 22 AWG) <https://www.sparkfun.com/products/11367> (PRT-11367) View the entire wire category on our website here <https://www.sparkfun.com/categories/141> Special notes: Molex polarized connector foot print use with: PRT-08233 with associated crimp pins and housings. 2.54_SCREWTERM for use with PRT-10571. 3.5mm Screw Terminal footprints for PRT-08084 5mm Screw Terminal footprints for use with PRT-08432
J4 = ok-connectors-dev:CON_2.54MM_TH_2X20
J6 = ok-connectors-dev:CON_2.54MM_TH_2X2
L1 = ok-discretes-dev:INDUCTOR; JLCASSY: C75661
LED1 = ok-opto-dev:LED; JLCASSY: C2296
MOD1 = ok-modules-dev:WIDORA_MCORE-H616_V1: No description set
R1 R2 = ok-discretes-dev:RES; JLCASSY: C25905
R3 R8 R11 R12 R18 R20 R21 = ok-discretes-dev:RES; JLCASSY: C25076
R4 R5 R17 R19 = ok-discretes-dev:RES; JLCASSY: C25744
R6 = ok-discretes-dev:RES; JLCASSY: C11702
R7 = ok-discretes-dev:RES; JLCASSY: C25771
R9 R10 = ok-discretes-dev:RES; JLCASSY: C25871
R13-R16 = ok-discretes-dev:RES; JLCASSY: C25120
SW1 = ok-electromech-dev:PUSHBUTTON-6X6MM; JLCASSY: C620316
TP1-TP4 = ok-testdebug-dev:TP

## Net classes
0 default: width 0.152 mm, drill 0.25 mm, clearance 0.152 mm

## Board
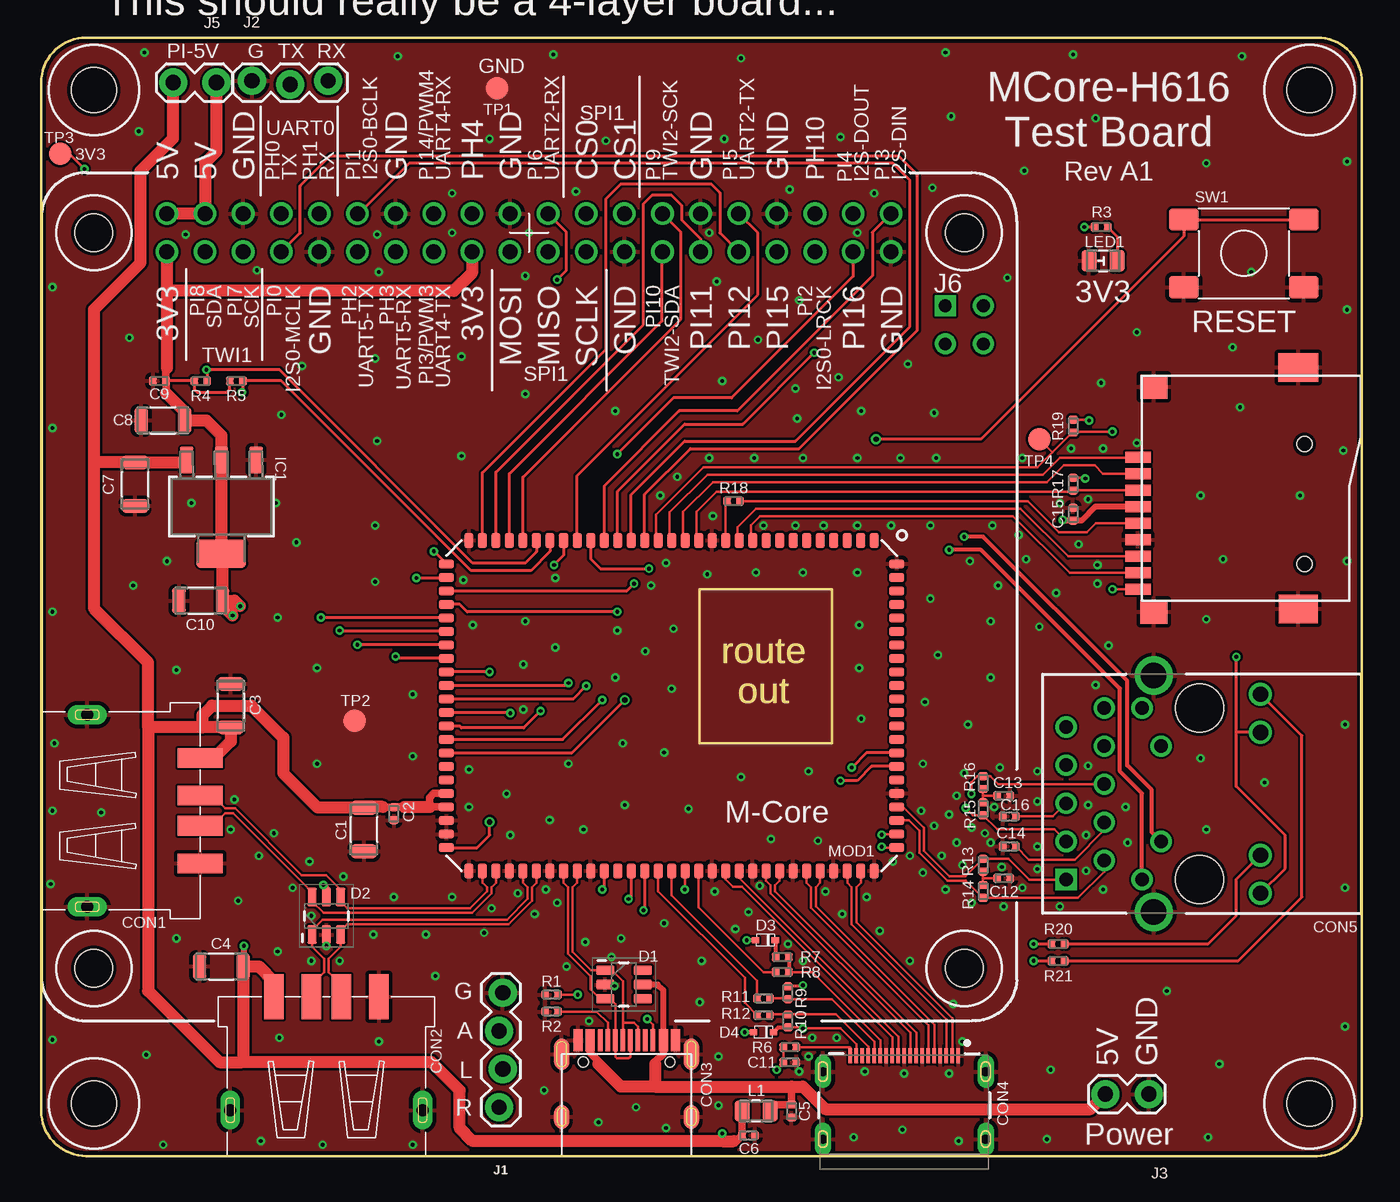
[diagram p3: board, top side]
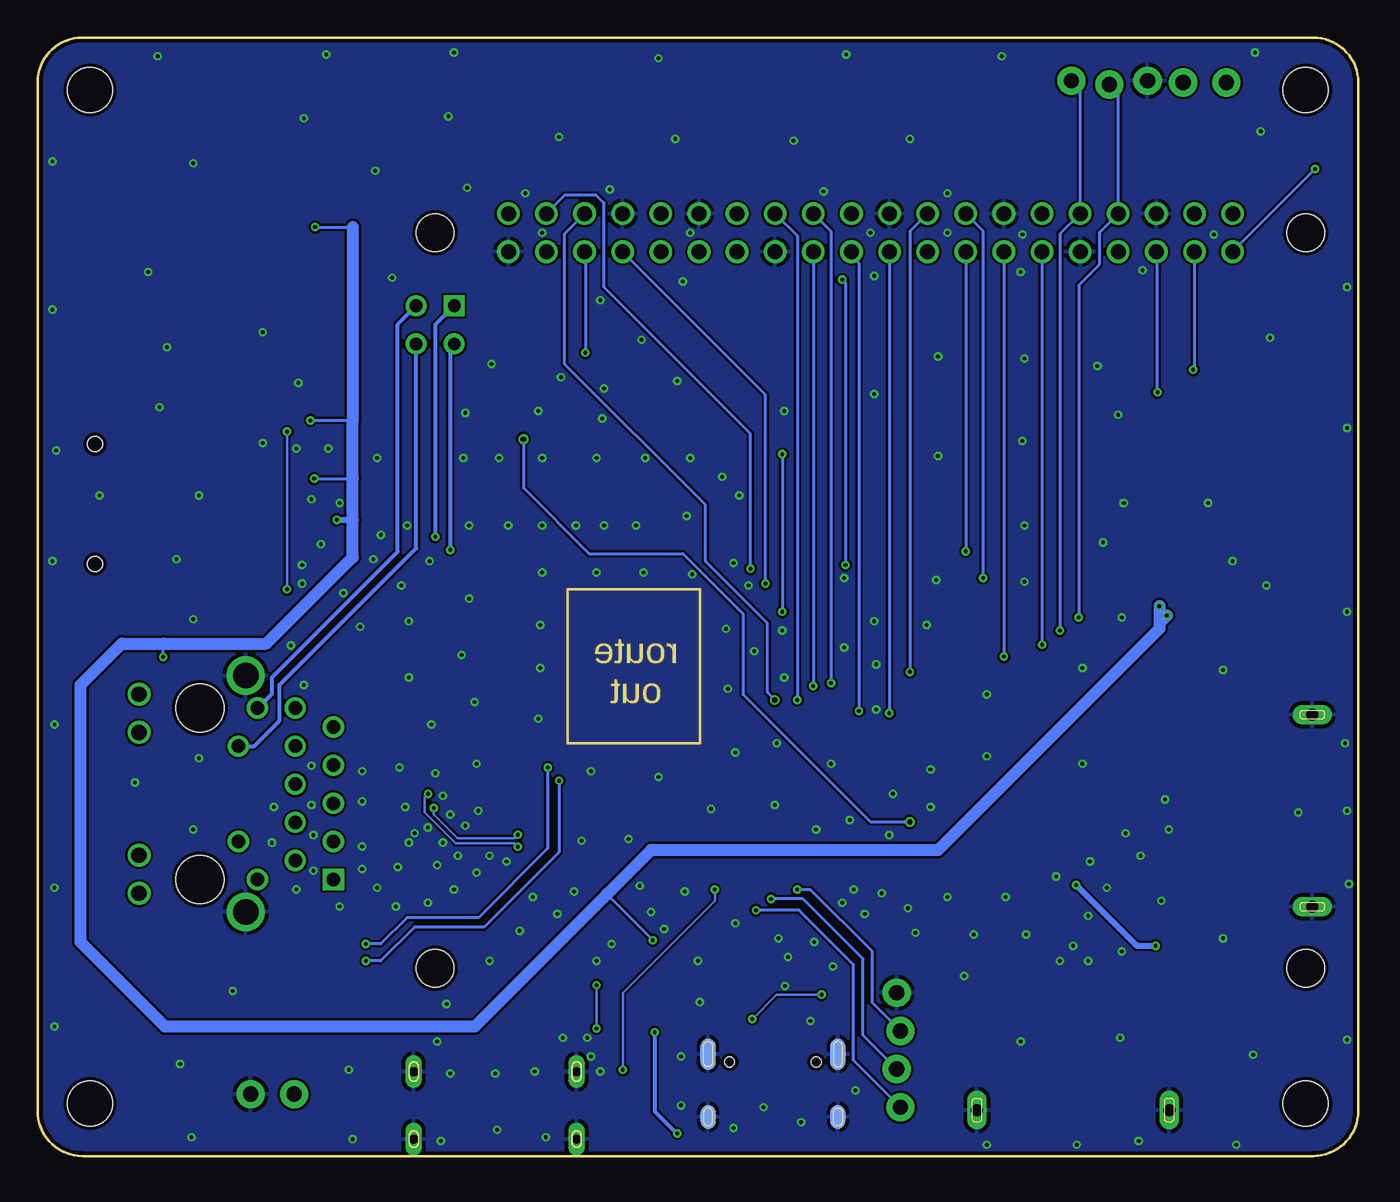
[diagram p4: board, bottom side, seen from below]

Size 88 x 74.5 mm. Coordinates in mm from the lower left corner, seen from the top.
Outline: 3,74.5 85,74.5 arc-90 88,71.5 88,3 arc-90 85,0 3,0 arc-90 0,3 0,71.5 arc-90 3,74.5
Copper layers (1*16): Top 0.035mm / dielectric 1.5mm / Bottom 0.035mm
Design rules "dirt_cheap_dirty_boards.v1.1": minimum track width 6mil, minimum drill 12mil, track to track 6mil, track to pad 6mil, pad to pad 6mil, via to via 6mil, smd to smd 0mil, copper to edge 10mil, drill to drill 10mil, minimum pad ring 10mil, minimum via ring 6mil, stop-mask expansion 2mil, vias tented up to drill 25mil, thermal gap 10mil
Holes 3 mm at 3.5,3.5 84.5,71 84.5,3.5 3.5,71
Holes 2.5 mm at 3.5,61.5 3.5,12.5 61.5,61.5 61.5,12.5

### Footprints (pad centres in the part's own frame; a part is rotated, then mirrored left to right if it is on the bottom)
_PKG_C_1206 = smd 0.9 x 1.7: 1 -1.45,0; 2 1.45,0
_PKG_C_0402 = smd 0.54 x 0.6: 1 -0.43,0; 2 0.43,0
JING_912-121A2023S10100 = smd 1.3 x 3: DM 1,-5.3; DP -1,-5.3; GND -3.5,-5.3; VBUS 3.5,-5.3 | drill 0.8 long: P$5 -6.4,2.24; P$6 6.4,2.24
USBC_C-31-M-12 = smd 0.3 x 1.45: CC1 -1.25,3.005; CC2 1.75,3.005; DN1 0.25,3.005; DN2 -0.75,3.005; DP1 -0.25,3.005; DP2 0.75,3.005; SBU1 1.25,3.005; SBU2 -1.75,3.005 | smd 0.6 x 1.45: GND@1 -3.25,3.005; GND@2 3.25,3.005; VBUS@1 -2.45,3.005; VBUS@2 2.45,3.005 | smd 1 x 2.1: P$1 4.32,2.09; P$2 -4.32,2.09 | smd 1 x 1.6: P$3 -4.32,-2.09; P$4 4.32,-2.09 | smd 1 x 2.1 bottom: P$5 -4.32,2.09; P$8 4.32,2.09 | smd 1 x 1.6 bottom: P$6 -4.32,-2.09; P$7 4.32,-2.09 | hole 0.65: 2.89,1.56; -2.89,1.56
685119136923 = smd 0.23 x 1: 1 3.6,1.05; 2 3.2,1.05; 3 2.8,1.05; 4 2.4,1.05; 5 2,1.05; 6 1.6,1.05; 7 1.2,1.05; 8 0.8,1.05; 9 0.4,1.05; 10 0,1.05; 11 -0.4,1.05; 12 -0.8,1.05; 13 -1.2,1.05; 14 -1.6,1.05; 15 -2,1.05; 16 -2.4,1.05; 17 -2.8,1.05; 18 -3.2,1.05; 19 -3.6,1.05 | drill 0.6 long: SHELL -5.425,0; SHELL1 5.425,0; SHELL2 -5.425,-4.5; SHELL3 5.425,-4.5
LPJG0926HENL = drill 0.9 pad 1.4 square: 1 -5.715,9.065 | drill 0.9 pad 1.4: 2 -4.445,6.525; 3 -3.175,9.065; 4 -1.905,6.525; 5 -0.635,9.065; 6 0.635,6.525; 7 1.905,9.065; 8 3.175,6.525; 9 4.445,9.065; 10 5.715,6.525; 11 -5.715,4.005; 12 -3.175,2.735; 13 3.175,2.735; 14 5.715,4.005 | drill 1.02 pad 1.53: 15 -6.63,-3.885; 16 -4.09,-3.885; 17 4.09,-3.885; 18 6.63,-3.885 | drill 1.7 pad 2.55: MH3 -7.875,3.225; MH4 7.875,3.225 | hole 3.2: -5.715,0.175; 5.715,0.175
TF/SHENZHEN-SPECIAL = smd 0.75 x 1.7: 1 -2.05,-7.55; 2 -0.95,-7.55; 3 0.15,-7.55; 4 1.25,-7.55; 5 2.35,-7.55; 6 3.45,-7.55; 7 4.55,-7.55; 8 5.65,-7.55; 9 6.75,-7.55 | smd 1.6 x 1.8: S1 -6.746,-6.508; S4 8.254,-6.481 | smd 1.9 x 2.65: S2 -8.027,3.127 | smd 1.9 x 2.6: S3 8.054,3.127 | hole 1: -2.911,3.558; 5.07,3.558
SOT95P280X145-6N = smd 1.2 x 0.6: 1 -1.25,0.95; 2 -1.25,0; 3 -1.25,-0.95; 4 1.25,-0.95; 5 1.25,0; 6 1.25,0.95
_PKG_SOD523 = smd 0.48 x 0.4: 1 -0.66,0; 2 0.66,0
_PKG_SOT223-4_TI-DCY4 = smd 0.889 x 1.765: 1 -2.311,-3.118; 2 0,-3.118; 3 2.311,-3.118 | smd 3.302 x 1.905: 4 0,3.124
1X04_LOCK = drill 1.016 pad 1.88: 1 0,0.127; 2 2.54,-0.127; 3 5.08,0.127; 4 7.62,-0.127
1X03_LOCK = drill 1.016 pad 1.88: 1 0,0.127; 2 2.54,-0.127; 3 5.08,0.127
1X02_LOCK = drill 1.016 pad 1.88: 1 -0.178,0; 2 2.718,0
CON_2.54MM_TH_2X20 = drill 1: P$1 -24.13,-1.27; P$2 -24.13,1.27; P$3 -21.59,-1.27; P$4 -21.59,1.27; P$5 -19.05,-1.27; P$6 -19.05,1.27; P$7 -16.51,-1.27; P$8 -16.51,1.27; P$9 -13.97,-1.27; P$10 -13.97,1.27; P$11 -11.43,-1.27; P$12 -11.43,1.27; P$13 -8.89,-1.27; P$14 -8.89,1.27; P$15 -6.35,-1.27; P$16 -6.35,1.27; P$17 -3.81,-1.27; P$18 -3.81,1.27; P$19 -1.27,-1.27; P$20 -1.27,1.27; P$21 1.27,-1.27; P$22 1.27,1.27; P$23 3.81,-1.27; P$24 3.81,1.27; P$25 6.35,-1.27; P$26 6.35,1.27; P$27 8.89,-1.27; P$28 8.89,1.27; P$29 11.43,-1.27; P$30 11.43,1.27; P$31 13.97,-1.27; P$32 13.97,1.27; P$33 16.51,-1.27; P$34 16.51,1.27; P$35 19.05,-1.27; P$36 19.05,1.27; P$37 21.59,-1.27; P$38 21.59,1.27; P$39 24.13,-1.27; P$40 24.13,1.27
CON_2.54MM_TH_2X2 = drill 0.85 pad 1.4 square: 1 -1.27,1.27 | drill 0.85 pad 1.4: 2 -1.27,-1.27; 3 1.27,1.27; 4 1.27,-1.27
_PKG_C_0805 = smd 1 x 1.42: 1 -0.935,0; 2 0.935,0
_PKG_LED_0805 = smd 1 x 1.42: A 0.935,0; C -0.935,0
MCORE-H616_V1 = smd 0.6 x 1: 1 -13.5,-11; 2 -12.6,-11; 3 -11.7,-11; 4 -10.8,-11; 5 -9.9,-11; 6 -9,-11; 7 -8.1,-11; 8 -7.2,-11; 9 -6.3,-11; 10 -5.4,-11; 11 -4.5,-11; 12 -3.6,-11; 13 -2.7,-11; 14 -1.8,-11; 15 -0.9,-11; 16 0,-11; 17 0.9,-11; 18 1.8,-11; 19 2.7,-11; 20 3.6,-11; 21 4.5,-11; 22 5.4,-11; 23 6.3,-11; 24 7.2,-11; 25 8.1,-11; 26 9,-11; 27 9.9,-11; 28 10.8,-11; 29 11.7,-11; 30 12.6,-11; 31 13.5,-11; 54 13.5,11; 55 12.6,11; 56 11.7,11; 57 10.8,11; 58 9.9,11; 59 9,11; 60 8.1,11; 61 7.2,11; 62 6.3,11; 63 5.4,11; 64 4.5,11; 65 3.6,11; 66 2.7,11; 67 1.8,11; 68 0.9,11; 69 0,11; 70 -0.9,11; 71 -1.8,11; 72 -2.7,11; 73 -3.6,11; 74 -4.5,11; 75 -5.4,11; 76 -6.3,11; 77 -7.2,11; 78 -8.1,11; 79 -9,11; 80 -9.9,11; 81 -10.8,11; 82 -11.7,11; 83 -12.6,11; 84 -13.5,11 | smd 1 x 0.6: 32 15,-9.45; 33 15,-8.55; 34 15,-7.65; 35 15,-6.75; 36 15,-5.85; 37 15,-4.95; 38 15,-4.05; 39 15,-3.15; 40 15,-2.25; 41 15,-1.35; 42 15,-0.45; 43 15,0.45; 44 15,1.35; 45 15,2.25; 46 15,3.15; 47 15,4.05; 48 15,4.95; 49 15,5.85; 50 15,6.75; 51 15,7.65; 52 15,8.55; 53 15,9.45; 85 -15,9.45; 86 -15,8.55; 87 -15,7.65; 88 -15,6.75; 89 -15,5.85; 90 -15,4.95; 91 -15,4.05; 92 -15,3.15; 93 -15,2.25; 94 -15,1.35; 95 -15,0.45; 96 -15,-0.45; 97 -15,-1.35; 98 -15,-2.25; 99 -15,-3.15; 100 -15,-4.05; 101 -15,-4.95; 102 -15,-5.85; 103 -15,-6.75; 104 -15,-7.65; 105 -15,-8.55; 106 -15,-9.45
_PKG_R_0402 = smd 0.54 x 0.6: 1 -0.43,0; 2 0.43,0
GENERIC_SPNO_4P_6X6MM = smd 2 x 1.5: P$1 -4,2.25; P$2 4,2.25; P$3 -4,-2.25; P$4 4,-2.25
TP_DOT_1.5X1.5MM = smd 1.5 x 1.5: TP 0,0

### Placement (x,y rotation side)
C1  21.5,21.75 90 top
C2  23.5,22.8 90 top
C3  12.62,30 270 top
C4  12,12.62 0 top
C5  50,3 90 top
C6  47.12,1.38 180 top
C7  6.25,44.75 90 top
C8  8.11,49 0 top
C9  7.88,51.62 0 top
C10  10.62,37 0 top
C11  49.88,6.25 180 top
C12  64.12,18.5 180 top
C13  64.12,24 180 top
C14  64.5,20.62 0 top
C15  68.75,42.75 270 top
C16  64.5,22.62 0 top
CON1  5.3,23 90 top
CON2  19,5.3 180 top
CON3  39,4.7 0 top
CON4  57.5,5.62 0 top
CON5  77.35,24.13 90 top
CON6  80.62,44.5 270 top
D1  38.83,11.43 0 top
D2  19,16 90 top
D3  48.25,14.38 180 top
D4  48.12,8.25 180 top
IC1  12,43.25 180 top
J1  30.62,10.88 270 top
J2  14.04,71.5 0 top
J3  73.62,4.12 180 top
J4  32.5,61.5 0 top
J5  11.5,71.5 180 top
J6  61.5,55.36 0 top
L1  47.62,3 180 top
LED1  70.75,59.62 0 top
MOD1  42,30 180 top
R1  34,10.75 0 top
R2  34,9.62 0 top
R3  70.62,61.88 180 top
R4  10.62,51.62 0 top
R5  13,51.62 0 top
R6  49.88,7.25 180 top
R7  49.38,13.25 180 top
R8  49.38,12.25 180 top
R9  49.75,10.88 270 top
R10  49.75,9 90 top
R11  48.12,10.5 180 top
R12  48.12,9.38 180 top
R13  62.75,19.38 90 top
R14  62.75,17.62 270 top
R15  62.75,23.12 270 top
R16  62.75,24.88 90 top
R17  68.75,44.75 90 top
R18  46.12,43.62 180 top
R19  68.75,48.62 90 top
R20  67.75,14.12 180 top
R21  67.75,13 180 top
SW1  80.12,60.12 0 top
TP1  30.38,71.12 0 top
TP2  20.88,29 270 top
TP3  1.25,66.75 0 top
TP4  66.5,47.75 0 top

### Tracks (layer width: path | path; a pad name or v marks a point on that pad's centre or on a via)
5V  (via drill 0.25 pad 0.55)
  Top 0.254: D4.2 v46.88,8.25 | v45.38,1.5 45.38,1
  Top 0.406: D2.5 19,17.84 v18.8,18.05 | v13.5,14 13.5,12.68 C4.2
  Top 0.508: MOD1.49 26.15,24.15 25.88,23.88 25.88,23.25 MOD1.50 | L1.2 C6.2 46.32,1 46.12,1 | 22.75,23.25 22.77,23.23 C2.2 23.52,23.25 24.19,23.25
  Top 0.813: 3.5,46.38 3.5,56.38 6.62,59.5 6.62,65.62 8.78,67.78 J5.2 | 3.5,46.38 3.5,36.5 7.12,32.88 7.12,28.62 | 7.12,28.62 7.12,11 11.88,6.25 13.38,6.25 | 13.38,6.25 13.45,6.33 C4.2 14.5,12.62 15.5,11.62 CON2.VBUS | CON1.VBUS 11.5,26.5 12.62,27.62 C3.2 10.75,28.55 | 10.75,28.55 7.2,28.55 7.12,28.62 | 3.5,46.38 3.67,46.2 C7.2 9.52,46.2 IC1.3 | 10.75,28.55 10.75,29.38 11.38,30 14,30 16.12,27.88 16.12,25.5 18.43,23.2 C1.2 21.55,23.25 22.75,23.25 | 24.19,23.25 25.88,23.25 | 46.12,1 45.38,1 28.75,1 27.88,1.88 27.88,4.38 26,6.25 13.38,6.25
  Bottom 0.254: v46.88,8.25 46.88,3 v45.38,1.5
  Bottom 0.406: v18.8,18.05 14.75,14 v13.5,14
GND  (via drill 0.25, 0.25 pad 0.55)
  Top 0.406: D1.2 38.1,11.43 v38.2,11.32
  other vias: 19,14 63.25,20.88 63.5,23.25 64,19.25 65.38,17.88 66.38,20.62 66.38,23.62 66.38,25.62 63.88,25.88 61.5,25.5 61,24 60.5,22.75 59.5,22 58.62,23 57.88,20 56.75,19.62 58.75,18.88 60,20 61,20.88 62,21.88 62.88,21.5 61.38,19.38 60.25,17.75 62,16.88 64.12,16.62 67.88,16.62 70.75,17.75 66.38,19.12 69.62,21.38 69.75,26 69.75,23.38 69.62,19 65.62,39.75 67.62,37.5 71.12,34 70.25,31.38 66.5,35.25 63.75,38 61.88,39.62 41.25,44 42.38,45.25 44.5,46.5 47.5,46.5 50.75,46.5 54.38,46.5 57.25,46.5 59.62,46.5 65.38,46.5 68.62,47.12 70.75,47.12 73,47.5 69.75,43.75 67.88,43.5 51.12,6.62 50.5,5.62 52.25,17.62 53.38,16.12 44.88,17.62 47.12,16.25 46.25,15.12 49.75,14.12 50.75,13 55,17.25 55.88,15 57.88,13 60.75,10.12 61.38,7.62 60.5,5.5 57.5,5.5 54.88,5.62 54.12,1.25 57.38,1.75 61.12,1 67,1.12 77.75,1.25 86.88,8.62 86.88,17.88 77.25,26.5 72.25,23.25 72.38,20.88 77.62,21.75 81.5,24.88 86.88,28.75 87,39.62 86.75,47 87,56.38 87,66.25 80,73.25 68.75,73.38 60.25,73.5 46.62,73.12 34.12,73.38 23.75,73.25 6.88,73.5 6.5,68.25 0.75,57.88 0.75,48.5 0.75,36.25 0.88,27.5 0.75,23 0.62,18.12 0.75,7.75 8.12,0.75 14.62,1 18.75,0.75 24.75,0.75 33.5,4.38 37.12,2.25 39.62,3.25 41.62,1.88 45.12,3.38 45.12,6.62 41.5,15.5 44,13 43.88,10.25 38.62,14.5 33.62,17.75 32.88,16.12 31.75,17.5 30,16.5 29.5,14.88 25.62,14.75 22.12,14.75 23.5,17.25 27.38,17.25 18,13 19.88,13 18,16 12.62,21.75 14.5,20 16.75,17.88 20.12,18.62 17.88,19.62 12.88,23.75 15.5,21.5 15.75,13.62 36.25,14.25 34.38,16.88 35,12.62 38,13.25 36.5,9 31.25,21.38 28.5,23.25 28.5,25.75 31,24.12 36.12,21.75 38.75,27.5 38.88,23.38 41.5,26.88 46.62,25.25 48.62,21.12 43.12,23.12 51.12,25.62 51.75,21 54.62,29.12 54.5,32.5 54.5,35.38 54.38,38.88 50.75,38.88 47.62,38.88 44.38,38.75 41.62,39.5 40.62,38 40.25,33.62 38.25,31.88 42.12,35.12 42,31.12 35.12,26.12 32.12,32.75 28.75,35.38 32.25,35.62 34.25,38.5 28.12,38.38 34.25,33.88 28,53.25 28,46.62 22.25,53.12 22.25,42 22.25,38.25 16,49.38 17,40.88 15.75,35.88 18.38,32.5 24.75,30.75 24.75,26.62 18.38,26.12 9,32.38 8.38,39.62 6.12,38 10,43.5 15.62,43.5 22.38,47.62 17.38,52.62 45,58.25 49.88,64.38 55.5,64.12 35.62,64.25 27.38,64.12 29.88,67.75 37.62,67.62 45.5,67.75 53.25,67.88 59.38,64.5 57.75,52.75 53.12,51.88 50.38,49.12 54.62,49.62 59.5,49.5 64.38,58.5 65.5,65.62 60.62,69.25 70.25,69.12 77.62,66.12 80.62,58.88 73,54.88 79.38,53.88 70.62,51.5 79.88,49.88 77.25,44 83.88,44 78.75,39.75 77.62,35.75 59.25,37.12 63.25,35.62 58.75,26.12 15.88,7.88 22.5,7.62 26.25,12 13.12,17 9,14.5 4,22.88 7,6.75 59.75,33.38 67.25,5.75 78.5,6.12 75,11 47.88,18 69.12,40.75 70.38,39.38 44.75,42.62 48.12,42 50.25,42 52.12,42 54.38,42 56.62,42 59.25,42 63.38,42 65.12,41.38 70.38,38.12 45.38,51.62 47.75,54.38 50.5,57 32.25,58.62 32.25,50.75 22.5,58.88 14.38,59 9.62,61.38 22.38,61.38 27.38,61.5 32.5,61.5 44.5,61.5 54.38,61.5 38.25,49.62 53,7.88 51.38,7.88 38.38,35 33.88,22.38 61.75,28.75 63.25,31.88 58.88,30.25 5.88,54.5 50.25,51.12 32.12,29.75
  pour Top: -1,76 -1,-1 89,-1 89,76
  pour Bottom: -1,76 -1,-1 89,-1 89,76
H5V  (via drill 0.25)
  Top 0.152: R10.1 50.68,8.57 v50.75,8.5 53.25,8.5 54.3,7.45 CON4.18
  Top 0.2: v50.75,11.38 50.68,11.3 R9.1
  Top 0.254: D4.1 49.1,8.57 R10.1
  Bottom 0.152: v50.75,11.38 v50.75,8.5
HCEC
  Top 0.152: MOD1.71 43.8,16.57 48.12,12.25 R8.2
HDCEC
  Top 0.152: CON4.14 55.9,7.72 51.38,12.25 R8.1
  Top 0.254: R7.1 R8.1
HDHPD
  Top 0.152: R6.1 53.88,7.25 53.9,7.22 CON4.19
HDSCL
  Top 0.152: R11.1 49.7,10.5 R9.2 52.68,10.45 55.5,7.62 CON4.15
HDSDA
  Top 0.152: R12.1 48.61,9.43 R10.2 52.95,9.43 55.1,7.28 CON4.16
HHPD  (via drill 0.25)
  Top 0.152: MOD1.70 42.9,17.77 v42.88,17.75 | R6.2 C11.2 49.45,6.2 v49,5.75
  Bottom 0.152: v49,5.75 49,10.88 42.88,17 v42.88,17.75
HSCL
  Top 0.152: MOD1.69 42,17.38 47.7,11.68 R11.2
HSDA
  Top 0.152: MOD1.68 41.1,17.65 46.88,11.88 46.88,10.2 R12.2
HTX0_N
  Top 0.152: MOD1.76 48.3,18.32 48.6,18.02 48.6,17.5 57.9,8.2 CON4.9
HTX0_P
  Top 0.152: MOD1.77 49.2,18.32 48.9,18.02 48.9,17.62 58.3,8.23 CON4.8
HTX1_N
  Top 0.152: MOD1.79 51,18.2 51.3,17.9 51.3,16.52 59.1,8.72 CON4.6
HTX1_P
  Top 0.152: MOD1.80 51.9,18.2 51.6,17.9 51.6,16.65 59.5,8.75 CON4.5
HTX2_N
  Top 0.152: MOD1.82 53.7,18.2 54,17.9 54,15.45 60.32,9.13 60.32,6.69 CON4.3
HTX2_P
  Top 0.152: MOD1.83 54.6,18.2 54.3,17.9 54.3,15.57 60.7,9.18 CON4.2
HTXC_N
  Top 0.152: MOD1.73 45.6,18.45 46.1,17.95 46.67,17.95 56.7,7.92 CON4.12
HTXC_P
  Top 0.152: MOD1.74 46.5,18.55 57.1,7.95 CON4.11
LAN_LED_G  (via drill 0.25 pad 0.55)
  Top 0.2: MOD1.92 54.98,26.85 v54,25.88 | v66.12,14.12 R20.2
  Bottom 0.2: v66.12,14.12 65.12,14.12 63.38,15.88 58.62,15.88 54,20.5 v54,25.88
LAN_LED_Y  (via drill 0.25 pad 0.55)
  Top 0.2: MOD1.91 55.33,25.95 54.38,25 v53.25,25 | v66.12,13 R21.2
  Bottom 0.2: v53.25,25 53.25,20.25 58.25,15.25 62.88,15.25 65.12,13 v66.12,13
LINEOUT_L  (via drill 0.25 pad 0.55)
  Top 0.203: MOD1.66 39.3,17.3 v39.12,17.12
  Bottom 0.203: J1.3 33,8.04 33,13.12 37,17.12 v39.12,17.12
LINEOUT_R  (via drill 0.25 pad 0.55)
  Top 0.203: MOD1.67 40.2,16.45 v40.12,16.38
  Bottom 0.203: J1.4 33.62,6.38 33.62,12.75 37.25,16.38 v40.12,16.38
LRADC  (via drill 0.25 pad 0.55)
  Top 0.203: MOD1.64 37.5,17.88 v37.38,17.75
  Bottom 0.203: J1.2 32.38,10.21 32.38,13.62 36.5,17.75 v37.38,17.75
N$1
  Top 0.2: R3.1 71.69,61.24 LED1.A
N$2
  Top 0.2: R20.1 77.75,14.12 79.62,16 79.62,18.43 CON5.16
N$3
  Top 0.152: C14.2 65.81,19.75 68.88,19.75 70.82,21.69 CON5.4
N$4
  Top 0.152: CON5.5 67.42,22.62 C16.2
N$5
  Top 0.813: J5.1 11.68,66.93 10.91,66.16 J4.P$4 J4.P$2
N$6
  Top 0.2: R21.1 79.75,13 84,17.25 84,28 CON5.18
N$7
  Top 0.254: D3.1 48.91,13.29 R7.2
N$9
  Top 0.152: CON3.CC1 37.75,8.88 37,9.62 R2.2
N$10  (via drill 0.25)
  Top 0.152: R1.2 v35.75,10.75 | v40.38,9.12 40.75,8.75 CON3.CC2
  Bottom 0.152: v35.75,10.75 38.75,10.75 v40.38,9.12
N$30
  Top 0.152: R13.1 62.75,18.5 | 62.75,18.5 R14.1 | C12.2 62.75,18.5
N$31
  Top 0.152: R16.1 62.75,24 | 62.75,24 R15.1 | C13.2 62.75,24
PH0/UART0-TX  (via drill 0.25 pad 0.55)
  Top 0.2: MOD1.36 18.65,35.85 v18.62,35.88
  Bottom 0.2: v18.62,35.88 18.62,58 17.25,59.38 17.25,61.51 J4.P$8 15.99,70.78 J2.2
PH1/UART0-RX  (via drill 0.25 pad 0.55)
  Top 0.2: v19.88,35 26.95,35 MOD1.37
  Bottom 0.2: v19.88,35 19.88,61.42 J4.P$10 18.53,71.04 J2.3
PH2/UART5-TX  (via drill 0.25 pad 0.55)
  Top 0.2: MOD1.38 v21.07,34.05
  Bottom 0.2: J4.P$11 v21.07,34.05
PH3/UART5-RX  (via drill 0.25 pad 0.55)
  Top 0.2: MOD1.39 23.73,33.15 v23.61,33.27
  Bottom 0.2: J4.P$13 v23.61,33.27
PH4  (via drill 0.25 pad 0.55)
  Top 0.2: v29.88,32.25 MOD1.40
  Bottom 0.2: J4.P$18 29.88,61.59 v29.88,32.25
PH10  (via drill 0.35)
  Top 0.2: MOD1.46 35.35,26.85 v38.88,30.38
  Bottom 0.2: v38.88,30.38 39.38,30.88 39.38,35.5 43.5,39.62 43.5,43.38 52.88,52.75 52.88,61.45 J4.P$36
PI0/I2S0-MCLK
  Top 0.2: MOD1.18 40.2,44.08 43.25,47.12 50.5,47.12 58.38,55 58.38,65.38 57.12,66.62 19.25,66.62 17.25,64.62 17.25,61.49 J4.P$7
PI1/I2S0-BCLK
  Top 0.2: MOD1.19 39.3,44.05 42.88,47.62 50.25,47.62 57.88,55.25 57.88,65 56.75,66.12 24.5,66.12 21.14,62.77 J4.P$12
PI2/I2S0-LRCK  (via drill 0.25 pad 0.55)
  Top 0.2: MOD1.20 38.4,44.27 42.88,48.75 46.75,48.75 v51.5,53.5
  Bottom 0.2: J4.P$35 51.5,60.18 v51.5,53.5
PI3/I2S0-DIN
  Top 0.2: J4.P$40 55.38,61.52 55.38,58.62 46.38,49.62 42.5,49.62 37.5,44.62 MOD1.21
PI4/I2S0-DOUT  (via drill 0.25 pad 0.55)
  Top 0.2: MOD1.22 36.6,39.77 37.25,39.12 v40.5,39.12
  Bottom 0.2: v40.5,39.12 40.5,48.12 50.25,57.88 50.25,63.47 50.78,64 52.88,64 54.09,62.78 J4.P$38
PI5/UART2-TX
  Top 0.2: MOD1.23 35.7,45.33 47.75,57.38 47.75,61.49 J4.P$32
PI6/UART2-RX  (via drill 0.25 pad 0.55)
  Top 0.2: MOD1.24 34.8,40.01 v34.17,39.38 | v34.38,58.38 35,59 35,61.54 J4.P$22
  Bottom 0.2: v34.38,58.38 34.17,58.17 v34.17,39.38
PI7/TWI1-SCK  (via drill 0.25 pad 0.55)
  Top 0.2: MOD1.25 33.9,40.27 32.62,39 28.62,39 16,51.62 R5.2 13.43,50.93 v13.38,50.88
  Bottom 0.2: v13.38,50.88 13.38,60.16 J4.P$5
PI8/TWI1-SDA  (via drill 0.25 pad 0.55)
  Top 0.2: MOD1.26 33,40.25 32.25,39.5 28.75,39.5 15.88,52.38 v11,52.38 11.05,52.32 R4.2
  Bottom 0.2: J4.P$3 10.91,52.47 v11,52.38
PI9/TWI2-SCK
  Top 0.2: MOD1.27 32.1,45.23 42.62,55.75 42.62,61.53 J4.P$28
PI10/TWI2-SDA
  Top 0.2: MOD1.28 31.2,45.45 41.38,55.62 41.38,60.22 J4.P$27
PI11
  Top 0.2: MOD1.29 30.3,45.55 40.12,55.38 40.12,63.43 40.72,64.03 41.97,64.03 42.67,63.33 42.67,62.35 43.93,61.1 J4.P$29
PI12
  Top 0.2: MOD1.30 29.4,45.52 37.62,53.75 37.62,63.75 38.62,64.75 44.62,64.75 45.21,64.16 45.21,61.49 J4.P$31
PI13/UART4-TX/PWM3  (via drill 0.25 pad 0.55)
  Top 0.2: MOD1.32 26.18,40.27 v26.15,40.27
  Bottom 0.2: J4.P$15 v26.15,40.27
PI14/UART4-RX/PWM4  (via drill 0.25 pad 0.55)
  Top 0.2: MOD1.33 26.95,38.5 v25,38.5
  Bottom 0.2: J4.P$16 25,61.62 v25,38.5
PI15  (via drill 0.25 pad 0.55)
  Top 0.2: MOD1.34 39.02,37.65 v39.5,38.12
  Bottom 0.2: v39.5,38.12 39.5,50.72 J4.P$33
PI16  (via drill 0.25 pad 0.55)
  Top 0.2: J4.P$37 54.09,58.59 46,50.5 42.12,50.5 v38.38,46.75 | v38.38,36.25 28.38,36.25 27.88,36.75 MOD1.35
  Bottom 0.2: v38.38,46.75 v38.38,36.25
RESET  (via drill 0.35 pad 0.55)
  Top 0.2: v55.62,47.75 62.62,47.75 76.12,61.25 SW1.P$1 SW1.P$2 | MOD1.53 29.05,20.55 29.88,21.38 v29.88,22.25
  Bottom 0.2: v55.62,47.75 55.62,44.5 51.25,40.12 45,40.12 41,36.12 41,30.75 32.5,22.25 v29.88,22.25
RXI_N  (via drill 0.25)
  Top 0.152: MOD1.85 56.2,20.55 56.15,20.6 v56,20.6 | CON5.6 63.79,24.77 63.25,25.3 R16.2 62.38,25.3 61.97,24.9 v61.97,24.12
  Bottom 0.152: v56,20.6 56.25,20.85 60.15,20.85 62.22,22.91 62.22,23.88 v61.97,24.12
RXI_P  (via drill 0.25)
  Top 0.152: MOD1.86 56.2,21.45 56.15,21.4 v56,21.4 | v61.59,23.18 62.08,22.7 R15.2 63.7,21.75 67.49,21.75 CON5.3
  Bottom 0.152: v56,21.4 56.25,21.15 60.03,21.15 61.62,22.75 61.62,23.15 v61.59,23.18
SCD0-CLK
  Top 0.152: MOD1.12 45.6,43.53 R18.2
SCD0-CLK'
  Top 0.152: CON6.5 70.28,42.15 69.69,41.56 67.81,41.56 65.75,43.62 R18.1
SCD0-CMD
  Top 0.152: MOD1.14 43.67,41.12 43.67,42.92 45,44.25 68.68,44.25 R17.1 68.78,44.35 CON6.3
SCD0-D0
  Top 0.152: MOD1.11 46.38,41.12 46.38,41.88 47.62,43.12 65.25,43.12 68.42,39.95 CON6.7
SCD0-D1
  Top 0.152: MOD1.10 47.27,41.12 47.27,42.02 47.88,42.62 64.75,42.62 68.53,38.85 CON6.8
SCD0-D2
  Top 0.152: MOD1.16 41.88,41.12 41.88,42.88 44.38,45.38 66.75,45.38 67.88,46.5 73.03,46.5 CON6.1
SCD0-D3
  Top 0.152: MOD1.15 42.77,41.12 42.77,42.9 44.75,44.88 67,44.88 68.12,46 70.19,46 70.74,45.45 CON6.2
SCD0-DET  (via drill 0.25 pad 0.55)
  Top 0.152: MOD1.17 40.98,41.12 40.98,42.73 44.12,45.88 66.38,45.88 67.38,46.88 | 67.38,46.88 68.69,48.2 R19.1 68.81,48.25 v71.38,48.25 | TP4.TP 67.38,46.88 | CON6.9 v71.38,37.75
  Bottom 0.152: v71.38,37.75 v71.38,48.25
SPI1-CLK  (via drill 0.25 pad 0.55)
  Top 0.2: MOD1.42 35.45,30.45 v36.31,31.31
  Bottom 0.2: J4.P$23 v36.31,31.31
SPI1-CS0  (via drill 0.25 pad 0.55)
  Top 0.2: MOD1.41 34.98,31.35 v35.12,31.5
  Bottom 0.2: J4.P$24 35.12,61.59 v35.12,31.5
SPI1-CS1  (via drill 0.25 pad 0.55)
  Top 0.2: MOD1.45 34.75,27.75 v37.38,30.38
  Bottom 0.2: J4.P$26 37.38,61.3 v37.38,30.38
SPI1-MISO  (via drill 0.25 pad 0.55)
  Top 0.2: MOD1.44 27.88,28.65 28,28.52 32.15,28.52 v33.27,29.64
  Bottom 0.2: J4.P$21 33.77,59.98 33.27,59.48 v33.27,29.64
SPI1-MOSI  (via drill 0.25 pad 0.55)
  Top 0.2: MOD1.43 31.2,29.55 v31.25,29.5
  Bottom 0.2: J4.P$19 31.23,29.52 v31.25,29.5
TR0_TAP  (via drill 0.25)
  Top 0.254: CON5.11 73.34,24.16 71.88,25.63 71.88,31.12 62.62,40.38 v60.5,40.38
  Bottom 0.254: J6.2 60.5,53.82 v60.5,40.38
TR1_TAP  (via drill 0.25)
  Top 0.254: CON5.12 73.99,21.58 73.98,24.39 72.36,26.02 72.36,31.64 62.75,41.25 v61.5,41.25
  Bottom 0.254: J6.1 61.5,55.36 v61.5,41.25
TR2_TAP
  Bottom 0.254: CON5.13 73.57,27.3 71.88,29 71.88,31.38 62.77,40.48 J6.4
TR3_TAP
  Bottom 0.254: CON5.14 72.38,30.81 72.38,31.88 64,40.25 64,55.4 J6.3
TXO_N
  Top 0.152: MOD1.87 57.8,22.35 58.5,21.66 58.5,20.19 60.37,18.32 61.62,18.32 R14.2 69.07,17.2 70.83,18.95 CON5.2
TXO_P
  Top 0.152: MOD1.88 57.43,23.25 58.8,21.88 58.8,20.32 60.5,18.62 61.57,18.62 R13.2 64.44,19.8 65.83,18.41 CON5.1
USB0_N
  Top 0.152: MOD1.61 34.8,18.2 35.1,17.9 35.1,13.47 36.6,11.97 36.6,11.1 37.23,10.47 D1.3 37.87,10.47 38.25,10.1 CON3.DN2 38.25,6.62 38.38,6.5 39.12,6.5 39.25,6.62 CON3.DN1
USB0_P
  Top 0.152: MOD1.62 35.7,18.2 35.4,17.9 35.4,13.6 36.62,12.38 D1.1 38.02,12.38 38.77,11.63 38.77,8.88 | 38.77,8.88 38.77,7.73 CON3.DP1 | CON3.DP2 39.75,8.62 39.5,8.88 38.77,8.88
USB1_N
  Top 0.152: MOD1.55 29.4,18.2 29.7,17.9 29.7,17.62 28.57,16.5 20.38,16.5 19.95,16.93 D2.4 19.95,17.74 18.97,18.72 17.34,18.72 12.9,23.15 12.25,23.15 11.4,24 CON1.DM
USB1_P
  Top 0.152: MOD1.56 30.3,18.2 30,17.9 30,17.5 28.7,16.2 18.8,16.2 18.05,16.95 D2.6 18.05,17.57 12.78,22.85 12.25,22.85 11.4,22 CON1.DP
USB2_N
  Top 0.152: MOD1.58 32.1,18.2 32.4,17.9 32.4,17.12 31.02,15.75 18.75,15.75 18.05,15.05 D2.1 18.05,13.95 18.85,13.15 18.85,12.25 18,11.4 CON2.DM
USB2_P
  Top 0.152: MOD1.59 33,18.2 32.7,17.9 32.7,17 31.15,15.45 20.38,15.45 19.95,15.02 D2.3 19.95,13.95 19.15,13.15 19.15,12.25 20,11.4 CON2.DP
VCC  (via drill 0.25, 0.25 pad 0.55)
  Top 0.152: R17.2 69.51,45.18 v69.56,45.12 | R19.2 69.76,49.05 v69.81,49
  Top 0.2: 79.62,28.25 79.62,24.62 82.88,21.38 82.88,19.14 CON5.15 | CON5.17 79.66,28.22 79.62,28.25 | v2.88,65.75 1.88,66.75 TP3.TP | C9.2 R4.1 10.2,51.05 10.38,50.88 12.38,50.88 12.57,51.07 R5.1 | 79.62,28.25 v79.62,33.25 | R3.2 v69.5,61.88
  Top 0.254: D3.2 v47,14.38
  Top 0.406: v68.06,42.38 68.12,42.32 C15.2 69.32,42.32 70.25,43.25 CON6.4
  Top 0.508: 8.38,52.5 8.3,52.43 C9.2 8.3,51.58 8.31,51.57 8.31,50.81
  Top 0.813: J4.P$17 28.69,58.81 27.5,57.62 8.5,57.62 | J4.P$1 8.37,57.76 8.5,57.62 | 8.5,57.62 8.38,57.5 8.38,52.5 | 8.31,50.81 9.56,49.57 C8.2 11,49 12,48 IC1.2 IC1.4 12.07,40.05 C10.2 | C10.2 12.88,37 v13.25,36.62 | C10.2 12.07,36.67 v12.75,36
  Bottom 0.2: J4.P$1 8.37,60.73 8.13,60.49 v2.88,65.75 | v79.62,33.25 79.62,34.12 | v69.81,49 67,49 | v69.56,45.12 67,45.12 | v69.5,61.88 67,61.88 | v47,14.38 50.06,17.44
  Bottom 0.406: v68.06,42.38 67,42.38
  Bottom 0.813: v13.25,36.62 13.25,35.75 | 13.25,35.75 13.12,35.62 v12.75,36 | 13.25,35.75 13.25,35.12 28,20.38 47.12,20.38 50.06,17.44 58.88,8.62 79.5,8.62 85.12,14.25 85.12,31.38 82.38,34.12 79.62,34.12 72.75,34.12 67,39.88 67,42.38 67,45.12 67,49 67,61.88
VUSB_IN
  Top 0.406: D1.5 41.08,11.43 41.45,11.05 CON3.VBUS@2
  Top 0.508: CON3.VBUS@1 36.55,6.87 37.12,6.3 37.12,6.12 | CON3.VBUS@2 41.45,6.83 40.91,6.28 40.91,6.12 | L1.1 48.99,3.43 C5.2 50,4.62
  Top 0.813: 40.91,4.62 38.62,4.62 37.12,6.12 | 40.91,6.12 40.91,4.62 | J3.2 69.91,3.12 52.25,3.12 50.75,4.62 50,4.62 40.91,4.62

### Text on the board
tPlace: This should really be a 4-layer board... | PI-5V | G | TX | RX | GND | SPI1 | MCore-H616 / Test Board | UART0 | 3V3 | Rev A1 | 5V | 5V | GND | PH0 | TX | PH1 | RX | PI1 | I2S0-BCLK | GND | PI14/PWM4 | UART4-RX | PH4 | GND | PI6 | UART2-RX | CS0 | CS1 | PI9 | TWI2-SCK | GND | PI5 | UART2-TX | GND | PH10 | PI4 | I2S-DOUT | PI3 | I2S-DIN | 3V3 | PI8 | SDA | PI7 | SCK | PI0 | I2S0-MCLK | GND | PH2 | UART5-TX | PH3 | UART5-RX | PI3/PWM3 | UART4-TX | 3V3 | MOSI | MISO | SCLK | GND | PI10 | TWI2-SDA | PI11 | PI12 | PI15 | PI2 | I2S0-LRCK | PI16 | GND | 3V3 | RESET | TWI1 | SPI1 | G | A | L | 5V | GND | R | Power